# Altium project S7CAS-PLEIADES-CARTE-MERE_P20.PrjPcb (part 1 of 5)
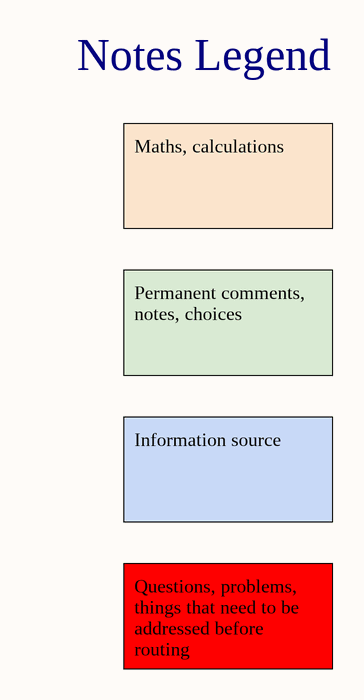
[diagram p0: S7CAS-PLEIADES-CARTE-MERE_P20_Title.SchDoc]
Project_Date: 24-01-12; Project_Designer1: Florent Cournoyer; Project_Designer2: Charles Normandeau; Project_Global: S7_APP1; Project_Group: P20: couf1001-norc2802; Project_Name: S7CAS-PLEIADES-CARTE-MERE_P20; Project_Revision: 1.00
20 sheets, 598 parts. Net scope: flat (ports and power ports of the same name join across sheets).
Board file: S7CAS-PLEIADES-CARTE-MERE-P20_PCBPcbDoc.PcbDoc
Sheets:
  S7CAS-PLEIADES-CARTE-MERE_P20_Title.SchDoc
  S7CAS-PLEIADES-CARTE-MERE_P20_Power-Tree-Analysis.SchDoc
  S7CAS-PLEIADES-CARTE-MERE_P20_Power-Tree-1.SchDoc
  S7CAS-PLEIADES-CARTE-MERE_P20_Power-Tree-2.SchDoc
  S7CAS-PLEIADES-CARTE-MERE_P20_Power-Tree-3.SchDoc
  S7CAS-PLEIADES-CARTE-MERE_P20_DDR3-FPGA-Bank-3.SchDoc
  S7CAS-PLEIADES-CARTE-MERE_P20_DDR3-Decoupling.SchDoc
  S7CAS-PLEIADES-CARTE-MERE_P20_Flash-Sensors-FPGA-bank-2.SchDoc
  S7CAS-PLEIADES-CARTE-MERE_P20_Mechanical-FPGA-Bank-0.SchDoc
  S7CAS-PLEIADES-CARTE-MERE_P20_FPGA-Unused-Banks.SchDoc
  S7CAS-PLEIADES-CARTE-MERE_P20_FPGA-Decoupling.SchDoc
  S7CAS-PLEIADES-CARTE-MERE_P20_Ethernet.SchDoc
  S7CAS-PLEIADES-CARTE-MERE_P20_USB.SchDoc
  S7CAS-PLEIADES-CARTE-MERE_P20_PLL.SchDoc
  S7CAS-PLEIADES-CARTE-MERE_P20_DAC.SchDoc
  S7CAS-PLEIADES-CARTE-MERE_P20_ADC.SchDoc
  S7CAS-PLEIADES-CARTE-MERE_P20_DAC-ADC-Spice-Models.SchDoc
  S7CAS-PLEIADES-CARTE-MERE_P20_DAC-ADC-Decoupling.SchDoc
  S7CAS-PLEIADES-CARTE-MERE_P20_Motor.SchDoc
  S7CAS-PLEIADES-CARTE-MERE_P20_Passive-Components.SchDoc

## Sheet S7CAS-PLEIADES-CARTE-MERE_P20_Title.SchDoc
size Tabloid; DocumentNumber: 1; SheetNumber: 1; SheetTotal: 19; Sheet_Name: Insert name in Document Parameters; Size: 11x17

### Notes on the sheet
- Notes Legend
- Maths, calculations
- Permanent comments, notes, choices
- Information source
- Questions, problems, things that need to be addressed before routing
- Revision history
- Package size conversion
- Metric
- 1005
- 1608
- Imperial
- 0402
- 0603
- Revision
- 2012
- 3216
- 0805
- 1206
- 3225
- 6432
- 1210
- 2512
- Date :
- Project Title
- Global Project
- Size
- Group
- Date
- Sheet
- of
- Filename
- Designers

## Sheet S7CAS-PLEIADES-CARTE-MERE_P20_Power-Tree-Analysis.SchDoc
size Tabloid; SheetNumber: 2; SheetTotal: 20; Sheet_Name: Power Tree Analysis; Size: 11x17

### Notes on the sheet
- Sheet Name
- Project Title
- Global Project
- Size
- Group
- Revision
- Date
- Sheet
- of
- Filename
- Designers
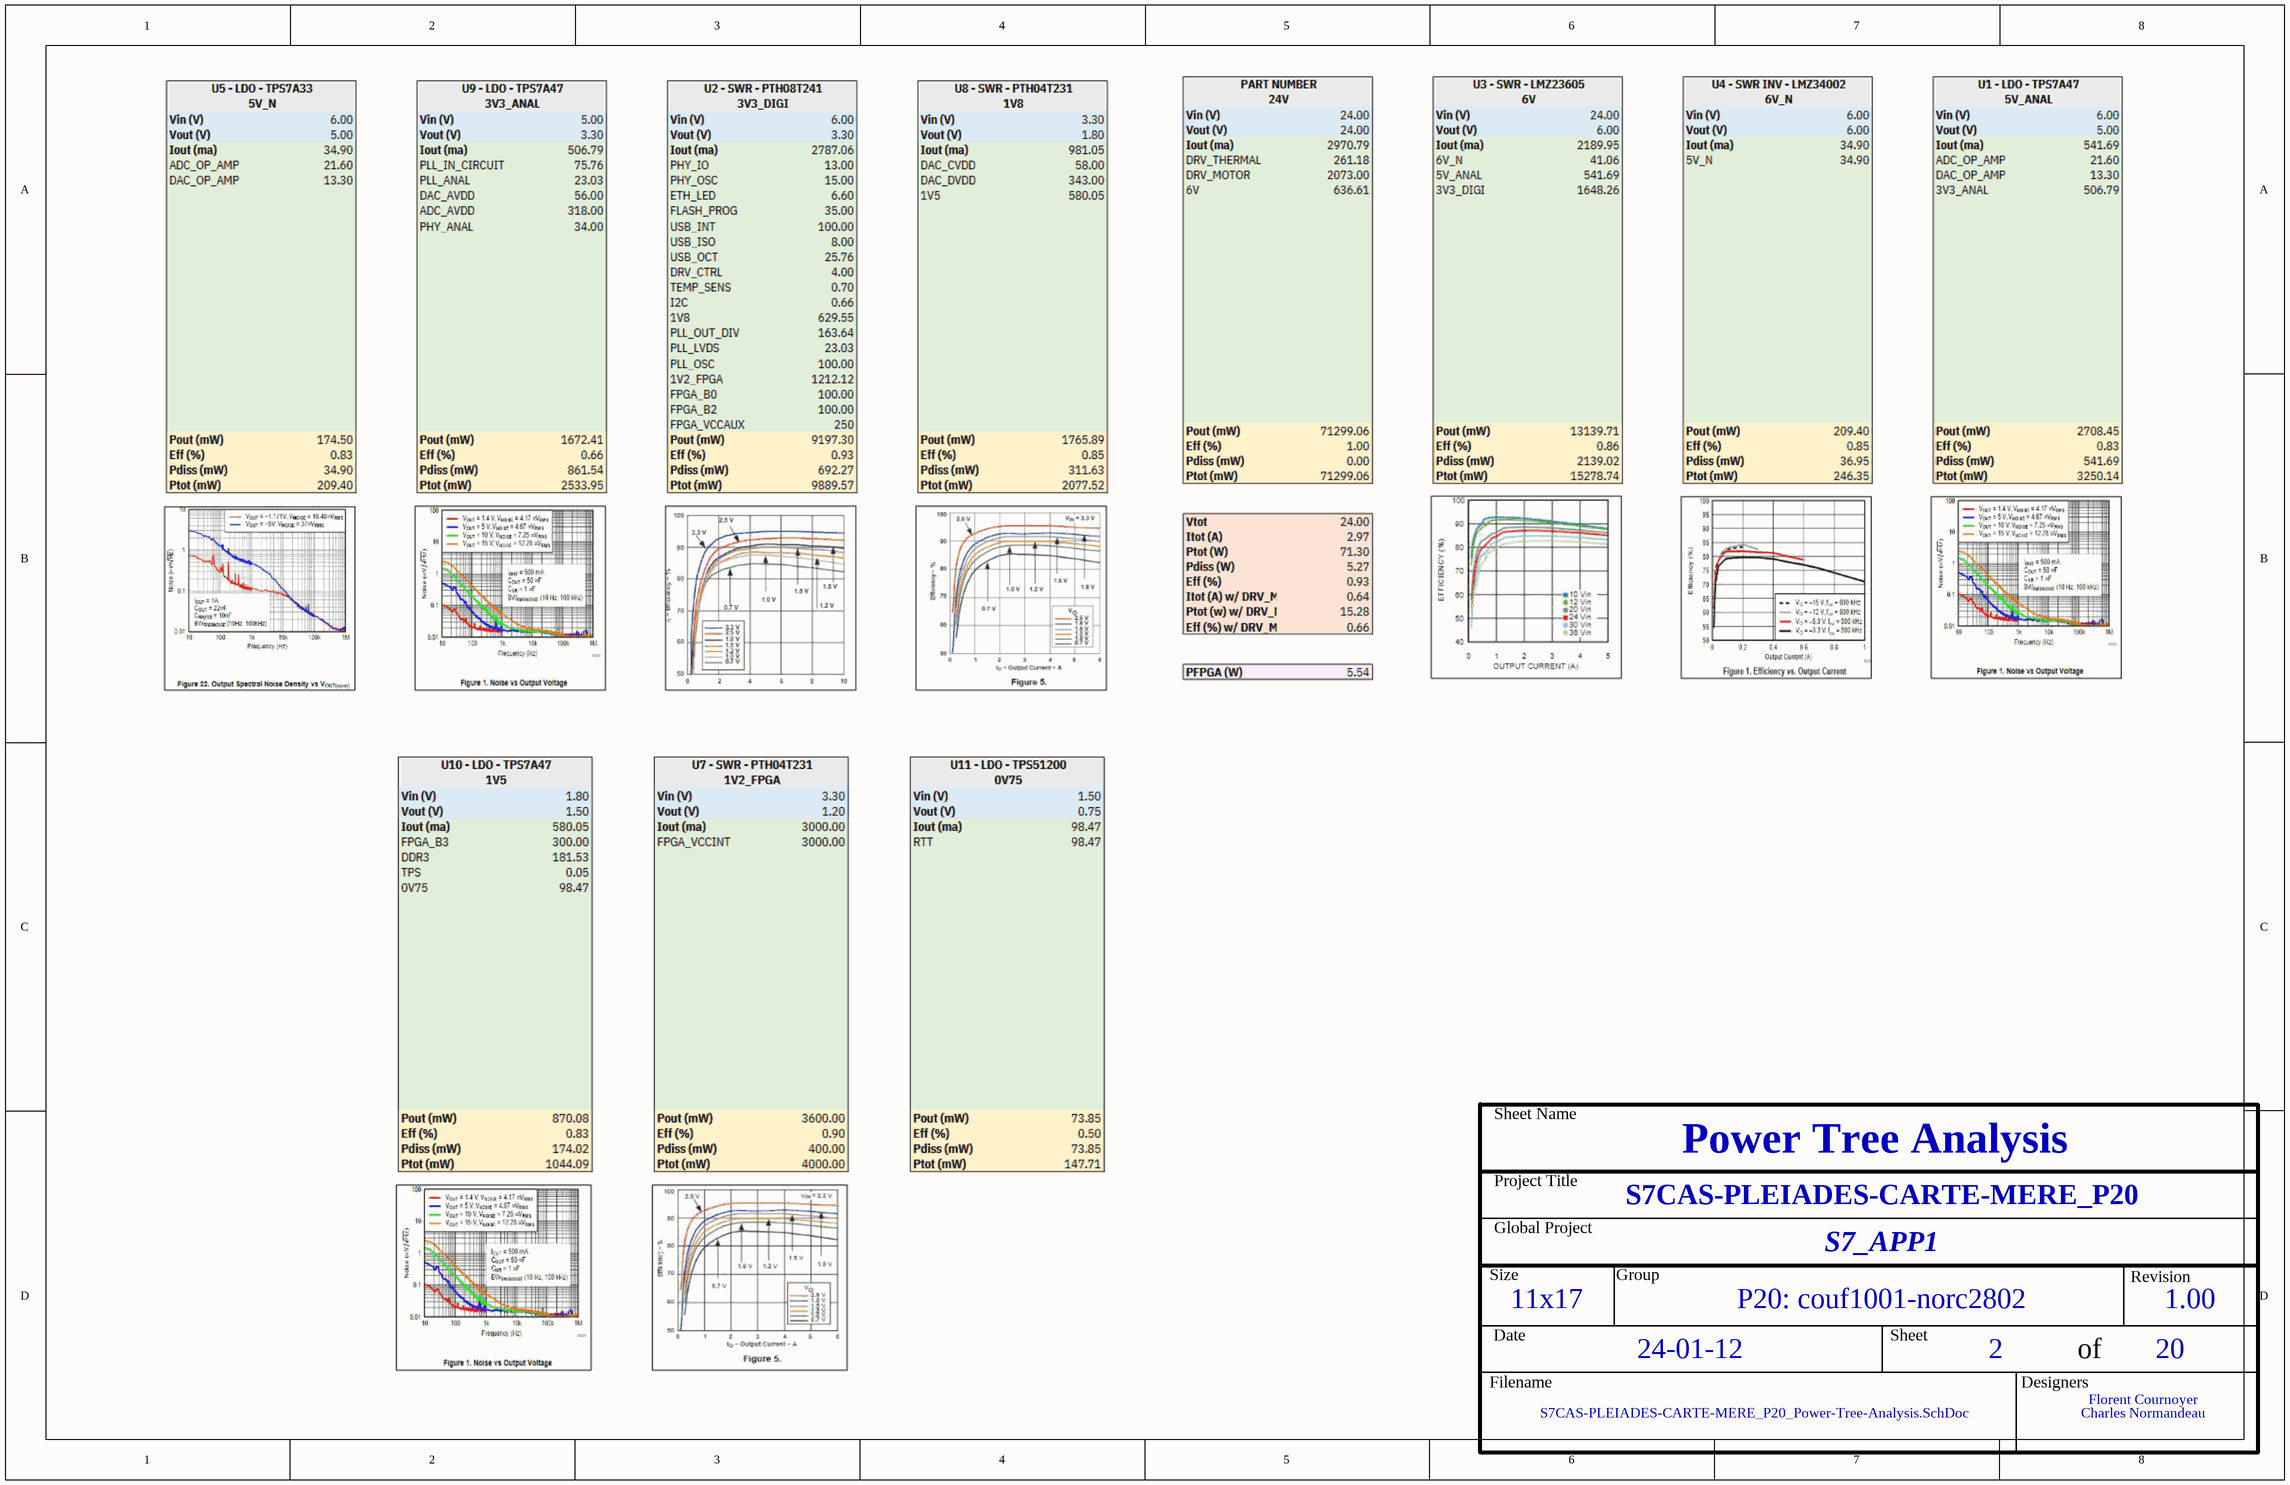
[diagram p1: S7CAS-PLEIADES-CARTE-MERE_P20_Power-Tree-Analysis.SchDoc]

## Sheet S7CAS-PLEIADES-CARTE-MERE_P20_Power-Tree-1.SchDoc
size Tabloid; SheetNumber: 3; SheetTotal: 20; Sheet_Name: Power Tree 1/3; Size: 11x17
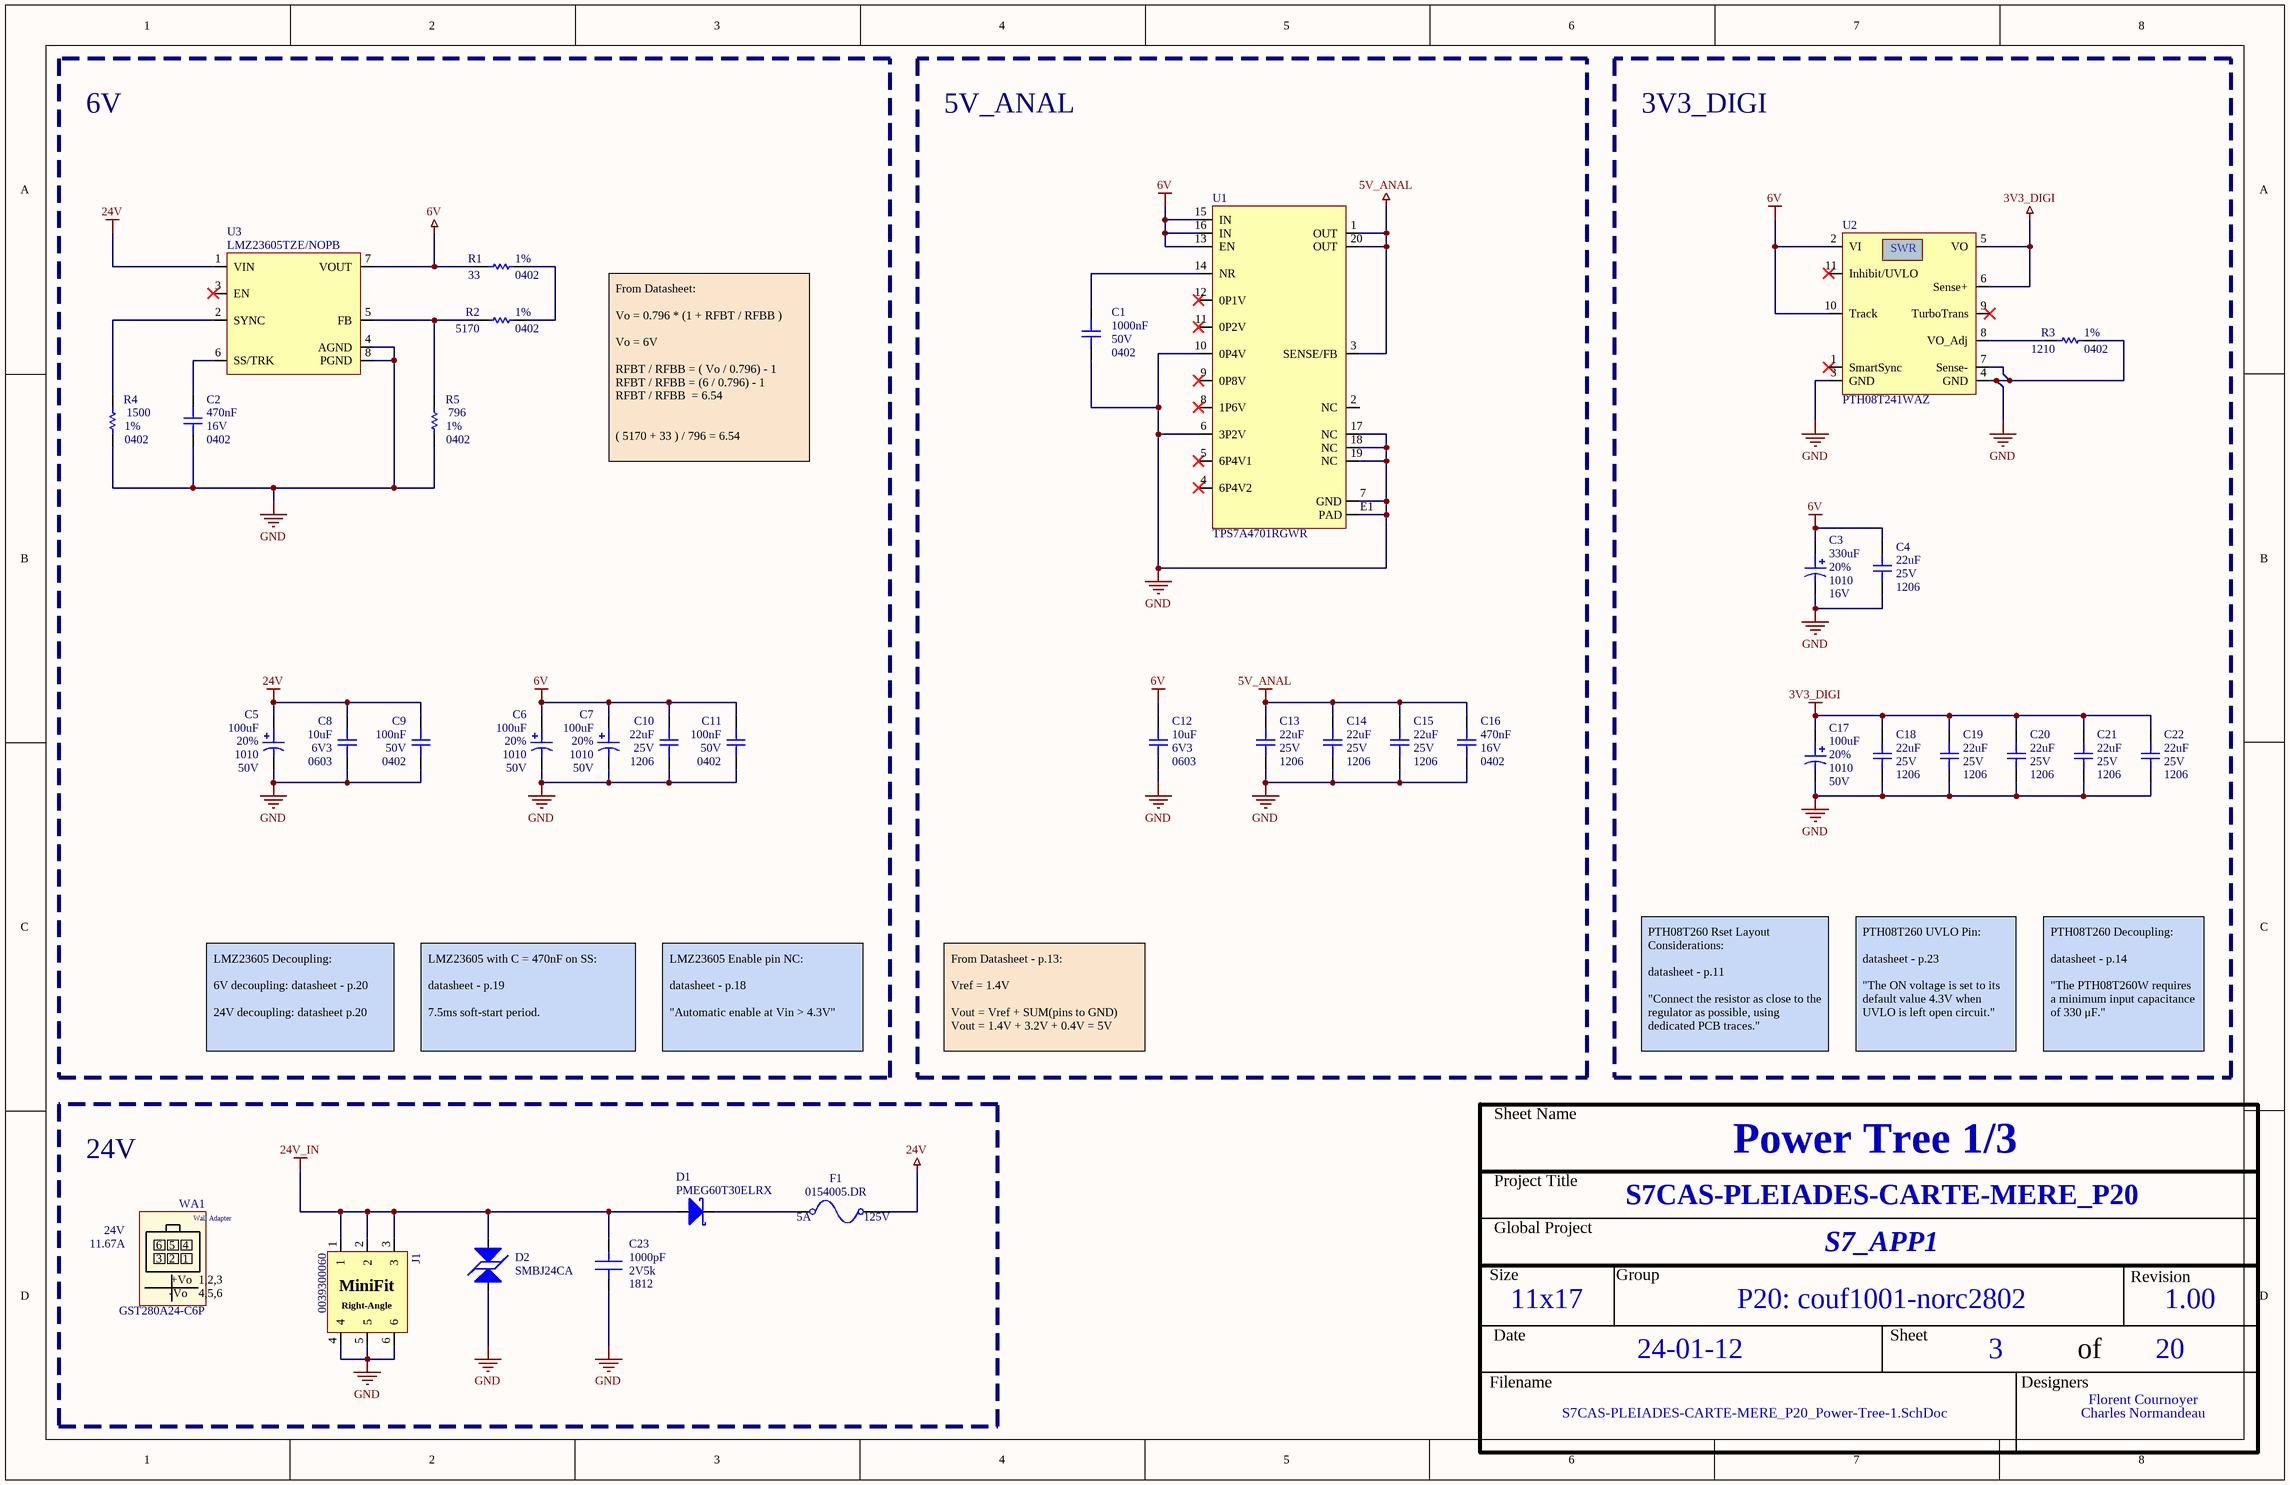
[diagram p2: S7CAS-PLEIADES-CARTE-MERE_P20_Power-Tree-1.SchDoc]

### Parts
C1  value 1000nF  Voltage: 50V  Package: 0402  [CAP_0402]  (hidden comment: CAP - 0402)
C2  value 470nF  Voltage: 16V  Package: 0402  [CAP_0402]  (hidden comment: CAP - 0402)
C3  value 330uF  Voltage: 16V  Package: 1010  Precision: 20%  [CAP_ALU_1010_vishay]  (hidden comment: MAL214699501E3)
C4  value 22uF  Voltage: 25V  Package: 1206  [CAP_1206]  (hidden comment: CAP - 1206)
C5  value 100uF  Voltage: 50V  Package: 1010  Precision: 20%  [CAP_ALU_1010_vishay]  (hidden comment: MAL215099101E3)
C6  value 100uF  Voltage: 50V  Package: 1010  Precision: 20%  [CAP_ALU_1010_vishay]  (hidden comment: MAL215099101E3)
C7  value 100uF  Voltage: 50V  Package: 1010  Precision: 20%  [CAP_ALU_1010_vishay]  (hidden comment: MAL215099101E3)
C8  value 10uF  Voltage: 6V3  Package: 0603  [CAP_0603]  (hidden comment: CAP - 0603)
C9  value 100nF  Voltage: 50V  Package: 0402  [CAP_0402]  (hidden comment: CAP - 0402)
C10  value 22uF  Voltage: 25V  Package: 1206  [CAP_1206]  (hidden comment: CAP - 1206)
C11  value 100nF  Voltage: 50V  Package: 0402  [CAP_0402]  (hidden comment: CAP - 0402)
C12  value 10uF  Voltage: 6V3  Package: 0603  [CAP_0603]  (hidden comment: CAP - 0603)
C13  value 22uF  Voltage: 25V  Package: 1206  [CAP_1206]  (hidden comment: CAP - 1206)
C14  value 22uF  Voltage: 25V  Package: 1206  [CAP_1206]  (hidden comment: CAP - 1206)
C15  value 22uF  Voltage: 25V  Package: 1206  [CAP_1206]  (hidden comment: CAP - 1206)
C16  value 470nF  Voltage: 16V  Package: 0402  [CAP_0402]  (hidden comment: CAP - 0402)
C17  value 100uF  Voltage: 50V  Package: 1010  Precision: 20%  [CAP_ALU_1010_vishay]  (hidden comment: MAL215099101E3)
C18  value 22uF  Voltage: 25V  Package: 1206  [CAP_1206]  (hidden comment: CAP - 1206)
C19  value 22uF  Voltage: 25V  Package: 1206  [CAP_1206]  (hidden comment: CAP - 1206)
C20  value 22uF  Voltage: 25V  Package: 1206  [CAP_1206]  (hidden comment: CAP - 1206)
C21  value 22uF  Voltage: 25V  Package: 1206  [CAP_1206]  (hidden comment: CAP - 1206)
C22  value 22uF  Voltage: 25V  Package: 1206  [CAP_1206]  (hidden comment: CAP - 1206)
C23  value 1000pF  Package: 1812  Voltage Rating: 2V5k  [CAP_CER_1812]  (hidden comment: 1812WC102KAT1A)
D1  PMEG60T30ELRX  [DIO_SCHOTTKY_PMEG60T30ELRX]
D2  SMBJ24CA  [TVS_PWR_SMBJ36CA]
F1  0154005.DR  Voltage Rating: 125V  Current Rating: 5A  [FUS_0154XXX.DR]
J1  0039300060  [CON_MINIFIT_0039300060]
R1  value 33  Package: 0402  Precision: 1%  [RES_0402]  (hidden comment: RES - 0402)
R2  value 5170  Package: 0402  Precision: 1%  [RES_0402]  (hidden comment: RES - 0402)
R3  value 1210  Package: 0402  Precision: 1%  [RES_0402]  (hidden comment: RES - 0402)
R4  value 1500  Package: 0402  Precision: 1%  [RES_0402]  (hidden comment: RES - 0402)
R5  value 796  Package: 0402  Precision: 1%  [RES_0402]  (hidden comment: RES - 0402)
U1  TPS7A4701RGWR  [REG_TPS7A4701RGWR]
U2  PTH08T241WAZ  [REG_SWR_PTH08T241WAZ]
U3  LMZ23605TZE/NOPB  [REG_SWR_LMZ23605TZE/NOPB]
WA1  GST280A24-C6P  value 24V  Current Rating: 11.67A  [Model Name]  (mechanical)

### Blocks framed on the sheet
6V: C2 C5-C11 R1 R2 R4 R5 U3
5V_ANAL: C1 C12-C16 U1
3V3_DIGI: C3 C4 C17-C22 R3 U2
24V: C23 D1 D2 F1 J1 WA1

### Nets
3V3_DIGI: C17.1 C18.2 C19.2 C20.2 C21.2 C22.2 U2.5(VO) U2.6(Sense+)
5V_ANAL: C13.2 C14.2 C15.2 C16.2 U1.1(OUT) U1.3(SENSE/FB) U1.20(OUT)
6V: C3.1 C4.2 C6.1 C7.1 C10.2 C11.2 C12.2 R1.2 U1.13(EN) U1.15(IN) U1.16(IN) U2.2(VI) U2.10(Track) U3.7(VOUT)
24V: C5.1 C8.2 C9.2 F1.2 U3.1(VIN)
24V_IN: C23.1 D1.A D2.1 J1.1 J1.2 J1.3
GND: C1.2 C2.1 C3.2 C4.1 C5.2 C6.2 C7.2 C8.1 C9.1 C10.1 C11.1 C12.1 C13.1 C14.1 C15.1 C16.1 C17.2 C18.1 C19.1 C20.1 C21.1 C22.1 C23.2 D2.2 J1.4 J1.5 J1.6 R3.1 R4.1 R5.1 U1.6(3P2V) U1.7(GND) U1.10(0P4V) U1.17(NC) U1.18(NC) U1.19(NC) U1.E1(PAD) U2.3(GND) U2.4(GND) U2.7(Sense-) U3.4(AGND) U3.8(PGND)
NetC1_1: C1.1 U1.14(NR)
NetC2_2: C2.2 U3.6(SS/TRK)
NetD1_K: D1.K F1.1
NetR1_1: R1.1 R2.1
NetR2_2: R2.2 R5.2 U3.5(FB)
NetR3_2: R3.2 U2.8(VO_Adj)
NetR4_2: R4.2 U3.2(SYNC)

Not connected (* = marked no-connect by the designer): U1 2(NC) 4(6P4V2)* 5(6P4V1)* 8(1P6V)* 9(0P8V)* 11(0P2V)* 12(0P1V)*; U2 1(SmartSync)* 9(TurboTrans)* 11(Inhibit/UVLO)*; U3 3(EN)*

### Notes on the sheet
- From Datasheet:
  Vo = 0.796 * (1 + RFBT / RFBB )
  Vo = 6V
  RFBT / RFBB = ( Vo / 0.796) - 1
  RFBT / RFBB = (6 / 0.796) - 1
  RFBT / RFBB  = 6.54
  ( 5170 + 33 ) / 796 = 6.54
- LMZ23605 Decoupling:
  6V decoupling: datasheet - p.20
  24V decoupling: datasheet p.20
- LMZ23605 with C = 470nF on SS:
  datasheet - p.19
  7.5ms soft-start period.
- LMZ23605 Enable pin NC:
  datasheet - p.18
  "Automatic enable at Vin > 4.3V"
- From Datasheet - p.13:
  Vref = 1.4V
  Vout = Vref + SUM(pins to GND)
  Vout = 1.4V + 3.2V + 0.4V = 5V
- PTH08T260 Rset Layout Considerations:
  datasheet - p.11
  "Connect the resistor as close to the regulator as possible, using dedicated PCB traces."
- PTH08T260 UVLO Pin:
  datasheet - p.23
  "The ON voltage is set to its default value 4.3V when UVLO is left open circuit."
- PTH08T260 Decoupling:
  datasheet - p.14
  "The PTH08T260W requires a minimum input capacitance of 330 μF."
- Sheet Name
- Project Title
- Global Project
- Size
- Group
- Revision
- Date
- Sheet
- of
- Filename
- Designers
- (in symbol CON_MINIFIT_0039300060) MiniFit; Right-Angle
- (in symbol REG_SWR_PTH08T241WAZ) SWR
- (in symbol UND_GST280A24-C6P) Wall Adapter; 6; 5; 4; 3; 2; 1; +Vo; 1,2,3; -Vo; 4,5,6

### Library data of the parts
C1 = CAP - 0402: Mfg Part Number: GXT155R61E105KE01; Precision: 10%; Current: *; CreatedBy: Jonathan Bouchard; Power: *
C2 C16 = CAP - 0402: Mfg Part Number: GXT155R61C474KE01; Precision: 10%; Current: *; CreatedBy: Jonathan Bouchard; Power: *
C3 = CAP_ALU_MAL214699501E3: CAP - ALU 330uF 20% 16V - 1010; Current: 750mA; Mfg: Vishay Dale; Mfg Part Number: MAL214699501E3; HelpURL: http://www.vishay.com/docs/28403/146cti.pdf; CreatedBy: Jonathan Bouchard; Temperature: -55°C to 125°C; Power: *; Supplier 1: Digikey; Supplier Part Number 1: 4405PHCT-ND
C4 C10 C13-C15 C18-C22 = CAP - 1206: Mfg Part Number: GRM31CC81E226KE11; Precision: 10%; Current: *; HelpURL: https://search.murata.co.jp/Ceramy/image/img/A01X/G101/ENG/GRM31CD71H106KE11-01A.pdf; CreatedBy: Jonathan Bouchard; Power: *
C5-C7 C17 = CAP_ALU_MAL215099101E3: CAP - ALU 100uF 20% 50V - 1010; Current: 490mA; Mfg: Vishay Dale; Mfg Part Number: MAL215099101E3; HelpURL: http://www.vishay.com/docs/28395/150crz.pdf; CreatedBy: Jonathan Bouchard; Temperature: -55°C to 125°C; Power: *; Supplier 1: Digikey; Supplier Part Number 1: 4399PHDKR-ND
C8 C12 = CAP - 0603: Mfg Part Number: GRM185R60J106ME15; Precision: 20%; Current: *; CreatedBy: Jonathan Bouchard; Power: *
C9 C11 = CAP - 0402: Mfg Part Number: GRM155R61H104KE14; Precision: 10%; Current: *; CreatedBy: Jonathan Bouchard; Power: *
C23 = CAP_CER_1812WC102KAT1A: CAP - CER 1000PF 2.5KV X7R - 1812; Tolerance: 10%; GRAMS Lib Spec: 2.7; Temperature: -55 to 125C
D1 = DIO_SCHOTTKY_PMEG60T30ELRX: DIO -  SCHOTTKY 60V 3A - SOD-123W; Manufacturer #1: Nexperia USA Inc.; GRAMS Lib Spec: 2.8c; Magnetic Material: UNKNOWN; Polarized: YES; Value: 620mV @ 3A; Assembly Type: SMD; CreatedBy/Date: Jonathan Bouchard 2020-03-23; Current Rating: 3A; HelpURL: https://assets.nexperia.com/documents/data-sheet/PMEG60T30ELR.pdf; Manufacturer #2: *; Note: *; Package: SOD-123W; Part Number #1: PMEG60T30ELRX; Part Number #2: *; Power Max: *; Supplier 1: Digi-Key; Supplier Part Number 1: 1727-7806-1-ND; Temperature: 175°C (Max); Tolerance: *; VerifiedBy: C.Paulin - 22/04/2020; Voltage Rating: 60V; Cryo: UNKNOWN; Mfg Part Number: PMEG60T30ELRX
D2 = TVS_PWR_SMBJ24CA: TVS - 24V 26.7V 600W - DO214AA; Manufacturer #1: Littelfuse Inc.; Value: Vbr = 26.7V -  Clamp = 38.9V; Voltage Rating: 24V Standoff; Current Rating: 15.5A; GRAMS Lib Spec: 2.8; Magnetic Material: UNKNOWN; Polarized: NO; Tolerance: *; Power Max: 600W; HelpURL: http://www.littelfuse.com/~/media/electronics/datasheets/tvs_diodes/littelfuse_tvs_diode_smbj_datasheet.pdf.pdf; CreatedBy/Date: Arnaud Samson - 06/07/18; VerifiedBy: Jonathan Bouchard - 2018-07-13; Temperature: -65°C ~ 150°C (TJ); Package: DO214AA; Manufacturer #2: *; Note: *; Assembly Type: SMD; Part Number #2: *; Part Number #1: SMBJ24CA; Supplier 1: Digi-Key; Supplier Part Number 1: SMBJ24CALFCT-ND; Cryo: UNKNOWN; Mfg Part Number: SMBJ24CA
F1 = FUS_0154005.DR: FUS - 5 A 125 VAC/VDC - 2-SMD; Manufacturer #1: Littelfuse Inc.; Value: 5A 125V AC/DC FAST; GRAMS Lib Spec: 2.8; Magnetic Material: UNKNOWN; Polarized: NO; Tolerance: *; Power Max: *; HelpURL: http://www.littelfuse.com/~/media/electronics/datasheets/fuses/littelfuse_fuse_154_154t_154l_154tl_datasheet.pdf.pdf; CreatedBy/Date: Arnaud Samson - 06/07/18; VerifiedBy: Jonathan Bouchard 2018-07-16; Temperature: -55°C ~ 125°C; Package: 2-SMD; Manufacturer #2: *; Note: *; Assembly Type: SMD; Part Number #2: *; Part Number #1: 0154005.DR; Supplier 1: Digi-Key; Supplier Part Number 1: F1228CT-ND; Cryo: UNKNOWN
J1 = CON_MINIFIT_0039300060: CON - Mini-Fit Through Hole, Right Angle 6 position; Manufacturer #1: Molex; Current Rating: 8A; GRAMS Lib Spec: 2.8; Magnetic Material: Unknown; Polarized: Yes; Voltage Rating: 600V; Assembly Type: TH; CreatedBy/Date: Joel Lemay 2018-06-21; HelpURL: https://www.molex.com/pdm_docs/sd/039300060_sd.pdf; Manufacturer #2: *; Package: TH; Part Number #1: 0039300060; Part Number #2: *; Power Max: *; Supplier 1: Digi-Key; Supplier Part Number 1: WM21353-ND; Temperature: - 40°C to + 80°C; Tolerance: *; Value: *; VerifiedBy: Caroline Paulin - 10 sept 2018; Cryo: UNKNOWN
R1 = RES - 0402: Mfg Part Number: CRCW040233R0FKEDC; Voltage: 50V; Power: 1/16W; Current: *; CreatedBy: Jonathan Bouchard
R2 = RES - 0402: Mfg Part Number: RN73H1ETTP5171F50; Voltage: 50V; Power: 1/16W; Current: *; CreatedBy: Jonathan Bouchard
R3 = RES - 0402: Mfg Part Number: CRCW04021K21FKEDC; Voltage: 50V; Power: 1/16W; Current: *; CreatedBy: Jonathan Bouchard
R4 = RES - 0402: Voltage: 50V; Power: 1/16W; Current: *; CreatedBy: Jonathan Bouchard
R5 = RES - 0402: Mfg Part Number: RN73H1ETTP7960F50; Voltage: 50V; Power: 1/16W; Current: *; CreatedBy: Jonathan Bouchard
U1 = REG_LDO_TPS7A4701RGWR: REG - LINEAR POS ADJ 1A - 20VQFN; Manufacturer #1: Texas Instruments; GRAMS Lib Spec: 2.8; Magnetic Material: Unknown; Polarized: Yes; Value: 1.4 à 34V; Voltage rating: 35V max; Assembly Type: SMD; CreatedBy/Date: L-P Gauthier / 2018-05-29; Current Rating: 1A; Manufacturer #2: TBD; Part Number #1: TPS7A4701RGWR; Part Number #2: TBD; Package: 20-VQFN Exposed Pad; Power Max: *; Tolerance: -; Supplier 1: Digi-Key; Supplier Part Number 1: 296-37224-1-ND; VerifiedBy: Caroline Paulin - 28 sept 2018; Temperature: -40°C ~ 125°C; HelpURL: http://www.ti.com/lit/ds/symlink/tps7a47.pdf; Cryo: UNKNOWN; Mfg Part Number: TPS7A4701RGWR
U2 = REG_SWR_PTH08T241WAZ: REG - MODULE PIP 10A 14VIN - 11-SMD; Manufacturer #1: Texas Instruments; Current Rating: 10A (out); Voltage rating: 4.5-14V (Input), 0.69 - 5.5V (Out); Polarized: Yes; Magnetic Material: UNKNOWN; Manufacturer #2: *; Note: *; Power Max: *; Value: *; Part Number #1: PTH08T241WAZ; Part Number #2: *; HelpURL: http://www.ti.com/lit/ds/symlink/pth08t241w.pdf; Supplier 1: Digi-Key; Supplier Part Number 1: 296-21339-ND; Assembly Type: SMD; Temperature: -40°C ~ 85°C; Package: SMD; CreatedBy/Date: Olivier Bernard / 6/5/2018; VerifiedBy: Caroline Paulin / 10 juillet 2018; Cryo: UNKNOWN; Mfg Part Number: PTH08T241WAZ
U3 = REG_SWR_LMZ23605TZE/NOPB: REG - IC BUCK SYNC 36V 5A - TO-PMOD-7; Manufacturer #1: Texas Instruments; Value: 0.8 ~ 6 V; Voltage Rating: 6 ~ 36 V; GRAMS Lib Spec: 2.8; Note: One Reflow; Magnetic Material: YES; Cryo: UNKNOWN; Tolerance: *; Current Rating: 5A; Power Max: *; HelpURL: http://www.ti.com/lit/ds/symlink/lmz23605.pdf; CreatedBy/Date: Arnaud Samson - 05/07/18; VerifiedBy: Jonathan Bouchard 2018-07-13; Temperature: -40°C ~ 125°C; Package: TO-PMOD-7; Manufacturer #2: *; Assembly Type: SMD; Part Number #2: *; Part Number #1: LMZ23605TZE/NOPB; Polarized: YES; Supplier 1: Digi-Key; Supplier Part Number 1: 296-35357-1-ND; Mfg Part Number: LMZ23605TZE/NOPB
WA1 = UND_GST280A24-C6P: UND - AC/DC DESKTOP ADAPTER 24V 280W - MEC; Manufacturer #1: MEAN WELL USA Inc.; Tolerance: ±3%; Voltage Rating: 85~264VAC; GRAMS Lib Spec: 2.8; Magnetic Material: Unknown; Polarized: Yes; Power Max: 280W; HelpURL: https://www.meanwell.com/Upload/PDF/GST280A/GST280A-SPEC.PDF; CreatedBy/Date: Caroline Paulin - 5 avril 2019; VerifiedBy: Nicolas V. (2019-07-05); Temperature: -30°C to +70°C; Package: -; Manufacturer #2: *; Note: *; Assembly Type: -; Part Number #2: *; Part Number #1: GST280A24-C6P; Supplier 1: Digi-Key; Supplier Part Number 1: 1866-2122-ND; Cryo: UNKNOWN; Mfg Part Number: GST280A24-C6P

## Sheet S7CAS-PLEIADES-CARTE-MERE_P20_Power-Tree-2.SchDoc
size Tabloid; SheetNumber: 4; SheetTotal: 20; Sheet_Name: Power Tree 2/3; Size: 11x17
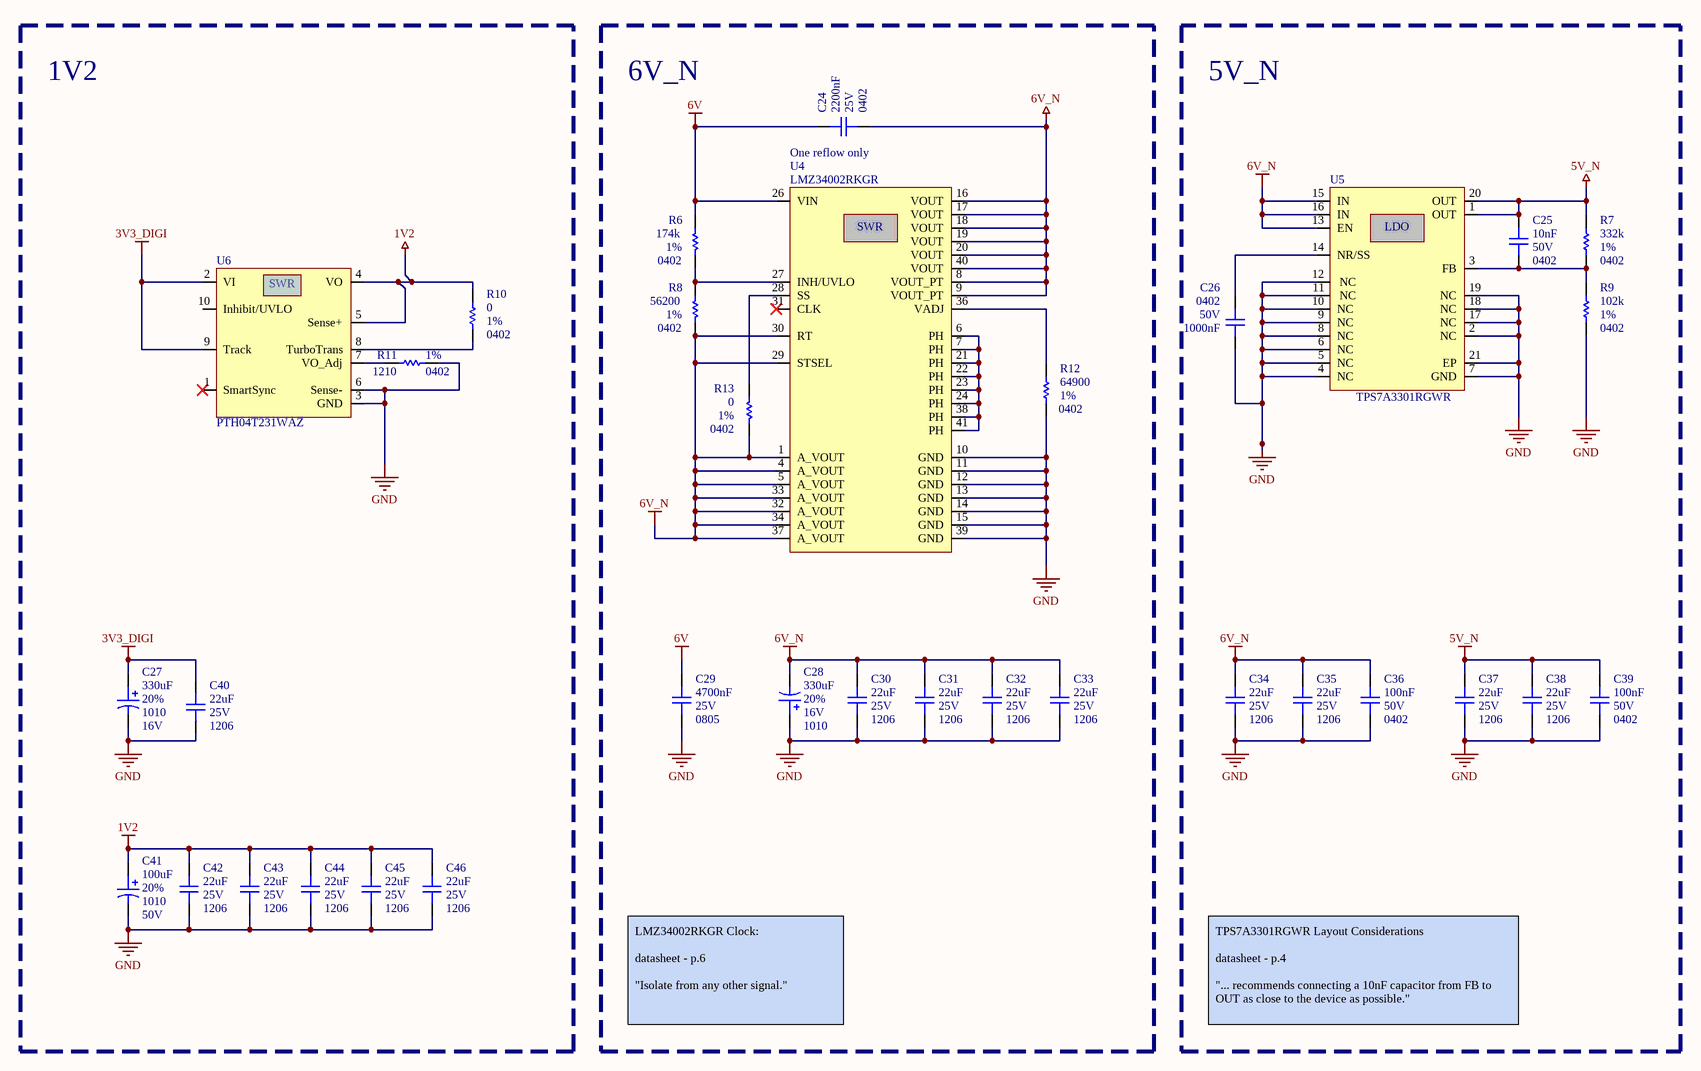
[diagram p3: S7CAS-PLEIADES-CARTE-MERE_P20_Power-Tree-2.SchDoc]

### Parts
C24  value 2200nF  Voltage: 25V  Package: 0402  [CAP_0402]  (hidden comment: CAP - 0402)
C25  value 10nF  Voltage: 50V  Package: 0402  [CAP_0603]  (hidden comment: CAP - 0603)
C26  value 1000nF  Voltage: 50V  Package: 0402  [CAP_0402]  (hidden comment: CAP - 0402)
C27  value 330uF  Voltage: 16V  Package: 1010  Precision: 20%  [CAP_ALU_1010_vishay]  (hidden comment: MAL214699501E3)
C28  value 330uF  Voltage: 16V  Package: 1010  Precision: 20%  [CAP_ALU_1010_vishay]  (hidden comment: MAL214699501E3)
C29  value 4700nF  Voltage: 25V  Package: 0805  [CAP_0805]  (hidden comment: CAP - 0805)
C30  value 22uF  Voltage: 25V  Package: 1206  [CAP_1206]  (hidden comment: CAP - 1206)
C31  value 22uF  Voltage: 25V  Package: 1206  [CAP_1206]  (hidden comment: CAP - 1206)
C32  value 22uF  Voltage: 25V  Package: 1206  [CAP_1206]  (hidden comment: CAP - 1206)
C33  value 22uF  Voltage: 25V  Package: 1206  [CAP_1206]  (hidden comment: CAP - 1206)
C34  value 22uF  Voltage: 25V  Package: 1206  [CAP_1206]  (hidden comment: CAP - 1206)
C35  value 22uF  Voltage: 25V  Package: 1206  [CAP_1206]  (hidden comment: CAP - 1206)
C36  value 100nF  Voltage: 50V  Package: 0402  [CAP_0402]  (hidden comment: CAP - 0402)
C37  value 22uF  Voltage: 25V  Package: 1206  [CAP_1206]  (hidden comment: CAP - 1206)
C38  value 22uF  Voltage: 25V  Package: 1206  [CAP_1206]  (hidden comment: CAP - 1206)
C39  value 100nF  Voltage: 50V  Package: 0402  [CAP_0402]  (hidden comment: CAP - 0402)
C40  value 22uF  Voltage: 25V  Package: 1206  [CAP_1206]  (hidden comment: CAP - 1206)
C41  value 100uF  Voltage: 50V  Package: 1010  Precision: 20%  [CAP_ALU_1010_vishay]  (hidden comment: MAL215099101E3)
C42  value 22uF  Voltage: 25V  Package: 1206  [CAP_1206]  (hidden comment: CAP - 1206)
C43  value 22uF  Voltage: 25V  Package: 1206  [CAP_1206]  (hidden comment: CAP - 1206)
C44  value 22uF  Voltage: 25V  Package: 1206  [CAP_1206]  (hidden comment: CAP - 1206)
C45  value 22uF  Voltage: 25V  Package: 1206  [CAP_1206]  (hidden comment: CAP - 1206)
C46  value 22uF  Voltage: 25V  Package: 1206  [CAP_1206]  (hidden comment: CAP - 1206)
R6  value 174k  Package: 0402  Precision: 1%  [RES_0402]  (hidden comment: RES - 0402)
R7  value 332k  Package: 0402  Precision: 1%  [RES_0402]  (hidden comment: RES - 0402)
R8  value 56200  Package: 0402  Precision: 1%  [RES_0402]  (hidden comment: RES - 0402)
R9  value 102k  Package: 0402  Precision: 1%  [RES_0402]  (hidden comment: RES - 0402)
R10  value 0  Package: 0402  Precision: 1%  [RES_0402]  (hidden comment: RES - 0402)
R11  value 1210  Package: 0402  Precision: 1%  [RES_0402]  (hidden comment: RES - 0402)
R12  value 64900  Package: 0402  Precision: 1%  [RES_0402]  (hidden comment: RES - 0402)
R13  value 0  Package: 0402  Precision: 1%  [RES_0402]  (hidden comment: RES - 0402)
U4  LMZ34002RKGR  Assembly Note: One reflow only  [REG_SWR_LMZ34002RKGR]
U5  TPS7A3301RGWR  [REG_LDO_TPS7A3301RGWR]
U6  PTH04T231WAZ  [REG_SWR_PTH04T231WAZ]

### Blocks framed on the sheet
1V2: C27 C40-C46 R10 R11 U6
6V_N: C24 C28-C33 R6 R8 R12 R13 U4
5V_N: C25 C26 C34-C39 R7 R9 U5

### Nets
1V2: C41.1 C42.2 C43.2 C44.2 C45.2 C46.2 R10.2 U6.4(VO) U6.5(Sense+)
3V3_DIGI: C27.1 C40.2 U6.2(VI) U6.9(Track)
5V_N: C25.2 C37.2 C38.2 C39.2 R7.2 U5.1(OUT) U5.20(OUT)
6V: C24.2 C29.2 R6.2 U4.26(VIN)
6V_N: C24.1 C28.2 C30.2 C31.2 C32.2 C33.2 C34.2 C35.2 C36.2 R8.1 R13.1 U4.1(A_VOUT) U4.4(A_VOUT) U4.5(A_VOUT) U4.8(VOUT_PT) U4.9(VOUT_PT) U4.16(VOUT) U4.17(VOUT) U4.18(VOUT) U4.19(VOUT) U4.20(VOUT) U4.29(STSEL) U4.30(RT) U4.32(A_VOUT) U4.33(A_VOUT) U4.34(A_VOUT) U4.37(A_VOUT) U4.40(VOUT) U5.13(EN) U5.15(IN) U5.16(IN)
GND: C26.1 C27.2 C28.1 C29.1 C30.1 C31.1 C32.1 C33.1 C34.1 C35.1 C36.1 C37.1 C38.1 C39.1 C40.1 C41.2 C42.1 C43.1 C44.1 C45.1 C46.1 R9.1 R11.1 R12.1 U4.10(GND) U4.11(GND) U4.12(GND) U4.13(GND) U4.14(GND) U4.15(GND) U4.39(GND) U5.2(NC) U5.4(NC) U5.5(NC) U5.6(NC) U5.7(GND) U5.8(NC) U5.9(NC) U5.10(NC) U5.11(NC) U5.12(NC) U5.17(NC) U5.18(NC) U5.19(NC) U5.21(EP) U6.3(GND) U6.6(Sense-)
NetC25_1: C25.1 R7.1 R9.2 U5.3(FB)
NetC26_2: C26.2 U5.14(NR/SS)
NetR6_1: R6.1 R8.2 U4.27(INH/UVLO)
NetR10_1: R10.1 U6.8(TurboTrans)
NetR11_2: R11.2 U6.7(VO_Adj)
NetR12_2: R12.2 U4.36(VADJ)
NetR13_2: R13.2 U4.28(SS)
NetU4_6: U4.6(PH) U4.7(PH) U4.21(PH) U4.22(PH) U4.23(PH) U4.24(PH) U4.38(PH) U4.41(PH)

Not connected (* = marked no-connect by the designer): U4 2(DNC) 3(DNC) 25(DNC) 31(CLK)* 35(DNC); U6 1(SmartSync)* 10(Inhibit/UVLO)

### Notes on the sheet
- LMZ34002RKGR Clock:
  datasheet - p.6
  "Isolate from any other signal."
- TPS7A3301RGWR Layout Considerations
  datasheet - p.4
  "... recommends connecting a 10nF capacitor from FB to OUT as close to the device as possible."
- Sheet Name
- Project Title
- Global Project
- Size
- Group
- Revision
- Date
- Sheet
- of
- Filename
- Designers
- (in symbol REG_LDO_TPS7A3301RGWR) LDO
- (in symbol REG_SWR_LMZ34002RKGR) SWR
- (in symbol REG_SWR_PTH04T231WAZ) SWR

### Library data of the parts
C24 = CAP - 0402: Mfg Part Number: GRM155R61E225KE11; Precision: 10%; Current: *; CreatedBy: Jonathan Bouchard; Power: *
C25 = CAP - 0603: Mfg Part Number: GRM155R71H103KA88; Precision: 10%; Current: *; CreatedBy: Jonathan Bouchard; Power: *
C26 = CAP - 0402: as C1 on sheet S7CAS-PLEIADES-CARTE-MERE_P20_Power-Tree-1; Current: *; CreatedBy: Jonathan Bouchard; Power: *
C27 C28 = CAP_ALU_MAL214699501E3: as C3 on sheet S7CAS-PLEIADES-CARTE-MERE_P20_Power-Tree-1; Mfg Part Number: MAL214699501E3; HelpURL: http://www.vishay.com/docs/28403/146cti.pdf; CreatedBy: Jonathan Bouchard; Temperature: -55°C to 125°C; Power: *; Supplier 1: Digikey; Supplier Part Number 1: 4405PHCT-ND
C29 = CAP - 0805: Mfg Part Number: GRM219R61E475KA73; Precision: 10%; Current: *; CreatedBy: Jonathan Bouchard; Power: *
C30-C35 C37 C38 C40 C42-C46 = CAP - 1206: as C4 on sheet S7CAS-PLEIADES-CARTE-MERE_P20_Power-Tree-1; Current: *; HelpURL: https://search.murata.co.jp/Ceramy/image/img/A01X/G101/ENG/GRM31CD71H106KE11-01A.pdf; CreatedBy: Jonathan Bouchard; Power: *
C36 C39 = CAP - 0402: as C9 on sheet S7CAS-PLEIADES-CARTE-MERE_P20_Power-Tree-1; Current: *; CreatedBy: Jonathan Bouchard; Power: *
C41 = CAP_ALU_MAL215099101E3: as C5 on sheet S7CAS-PLEIADES-CARTE-MERE_P20_Power-Tree-1; Mfg Part Number: MAL215099101E3; HelpURL: http://www.vishay.com/docs/28395/150crz.pdf; CreatedBy: Jonathan Bouchard; Temperature: -55°C to 125°C; Power: *; Supplier 1: Digikey; Supplier Part Number 1: 4399PHDKR-ND
R6 = RES - 0402: Mfg Part Number: CRCW0402174KFKEDC; Voltage: 50V; Power: 1/16W; Current: *; CreatedBy: Jonathan Bouchard
R7 = RES - 0402: Mfg Part Number: RK73H1FTTBL3323F; Voltage: 50V; Power: 1/32W; Current: *; CreatedBy: Jonathan Bouchard
R8 = RES - 0402: Voltage: 50V; Mfg: RS73F1ERTTP5622F; Power: 1/8W; Current: *; CreatedBy: Jonathan Bouchard
R9 = RES - 0402: Mfg Part Number: RMCF0402FT102K; Voltage: 50V; Power: 1/16W; Current: *; CreatedBy: Jonathan Bouchard
R10 R13 = RES - 0402: Mfg Part Number: CR200000F; Voltage: 50V; Power: 1/16W; Current: *; CreatedBy: Jonathan Bouchard
R11 = RES - 0402: as R3 on sheet S7CAS-PLEIADES-CARTE-MERE_P20_Power-Tree-1; Current: *; CreatedBy: Jonathan Bouchard
R12 = RES - 0402: Mfg Part Number: RMCF0402FT64K9; Voltage: 50V; Power: 1/16W; Current: *; CreatedBy: Jonathan Bouchard
U4 = REG_SWR_LMZ34002RKGR: REG - DC DC Converter -3V to -17V 2A - 41-B1QFN; Manufacturer #1: Texas Instruments; Value: -3 ~ -17V; Voltage Rating: 4.5-40V; Power Max: 15W; GRAMS Lib Spec: 2.8c; Magnetic Material: Unknown; Polarized: Yes; Tolerance: *; Current Rating: 2A; HelpURL: http://www.ti.com/lit/ds/symlink/lmz34002.pdf; CreatedBy/Date: P.Marcoux  20-06-2019; VerifiedBy: C.Paulin - 22/01/2020; Temperature: -40°C ~ 85°C; Package: 41-B1QFN; Manufacturer #2: *; Note: *; Assembly Type: SMD; Part Number #2: *; Part Number #1: LMZ34002RKGR; Supplier 1: Digi-Key; Supplier Part Number 1: 296-44356-1-ND; Cryo: UNKNOWN; Mfg Part Number: LMZ34002RKGR
U5 = REG_LDO_TPS7A3301RGWR: REG - LDO Negative Adjustable 1 Output -1.18V-33V 1A -  20-VQFN (5x5); Manufacturer #1: Texas Instruments; Value: -1.18V~-33V; Voltage Rating: -36V; GRAMS Lib Spec: 2.8; Magnetic Material: Unknown; Polarized: Yes; Tolerance: *; Current Rating: 1A; Power Max: *; HelpURL: http://www.ti.com/lit/ds/symlink/tps7a33.pdf; CreatedBy/Date: Keven Deslandes - 2018/10/11; VerifiedBy: Caroline Paulin - 11/12/2018; Temperature: -40°C ~ 125°C; Package: 20-VQFN; Manufacturer #2: *; Assembly Type: SMD; Part Number #2: *; Part Number #1: TPS7A3301RGWR; Supplier 1: Digi-Key; Supplier Part Number 1: 296-39502-1-ND; Cryo: UNKNOWN; Mfg Part Number: TPS7A3301RGWR
U6 = REG_SWR_PTH04T231WAZ: REG - MODULE PIP 6A 2.2V/5.5V - 10SMD; Manufacturer #1: Texas Instruments; Current Rating: 6A (out); Value: 0.69 - 3.6V (Out); Voltage rating: 2.2-5.5V (Input); Polarized: Yes; Magnetic Material: UNKNOWN; Manufacturer #2: *; Note: *; Power Max: *; Part Number #1: PTH04T231WAZ; Part Number #2: *; HelpURL: http://www.ti.com/lit/ds/symlink/pth04t231w.pdf; Supplier 1: Digi-Key; Assembly Type: SMD; Temperature: -40°C ~ 85°C; Supplier Part Number 1: 296-21792-ND; Package: SMD; CreatedBy/Date: Olivier Bernard / 6/5/2018; VerifiedBy: Caroline Paulin / 10 juillet 2018; Cryo: UNKNOWN; Mfg Part Number: PTH04T231WAZ; Parameter 2: *

## Sheet S7CAS-PLEIADES-CARTE-MERE_P20_Power-Tree-3.SchDoc
size Tabloid; SheetNumber: 5; SheetTotal: 20; Sheet_Name: Power Tree 3/3; Size: 11x17
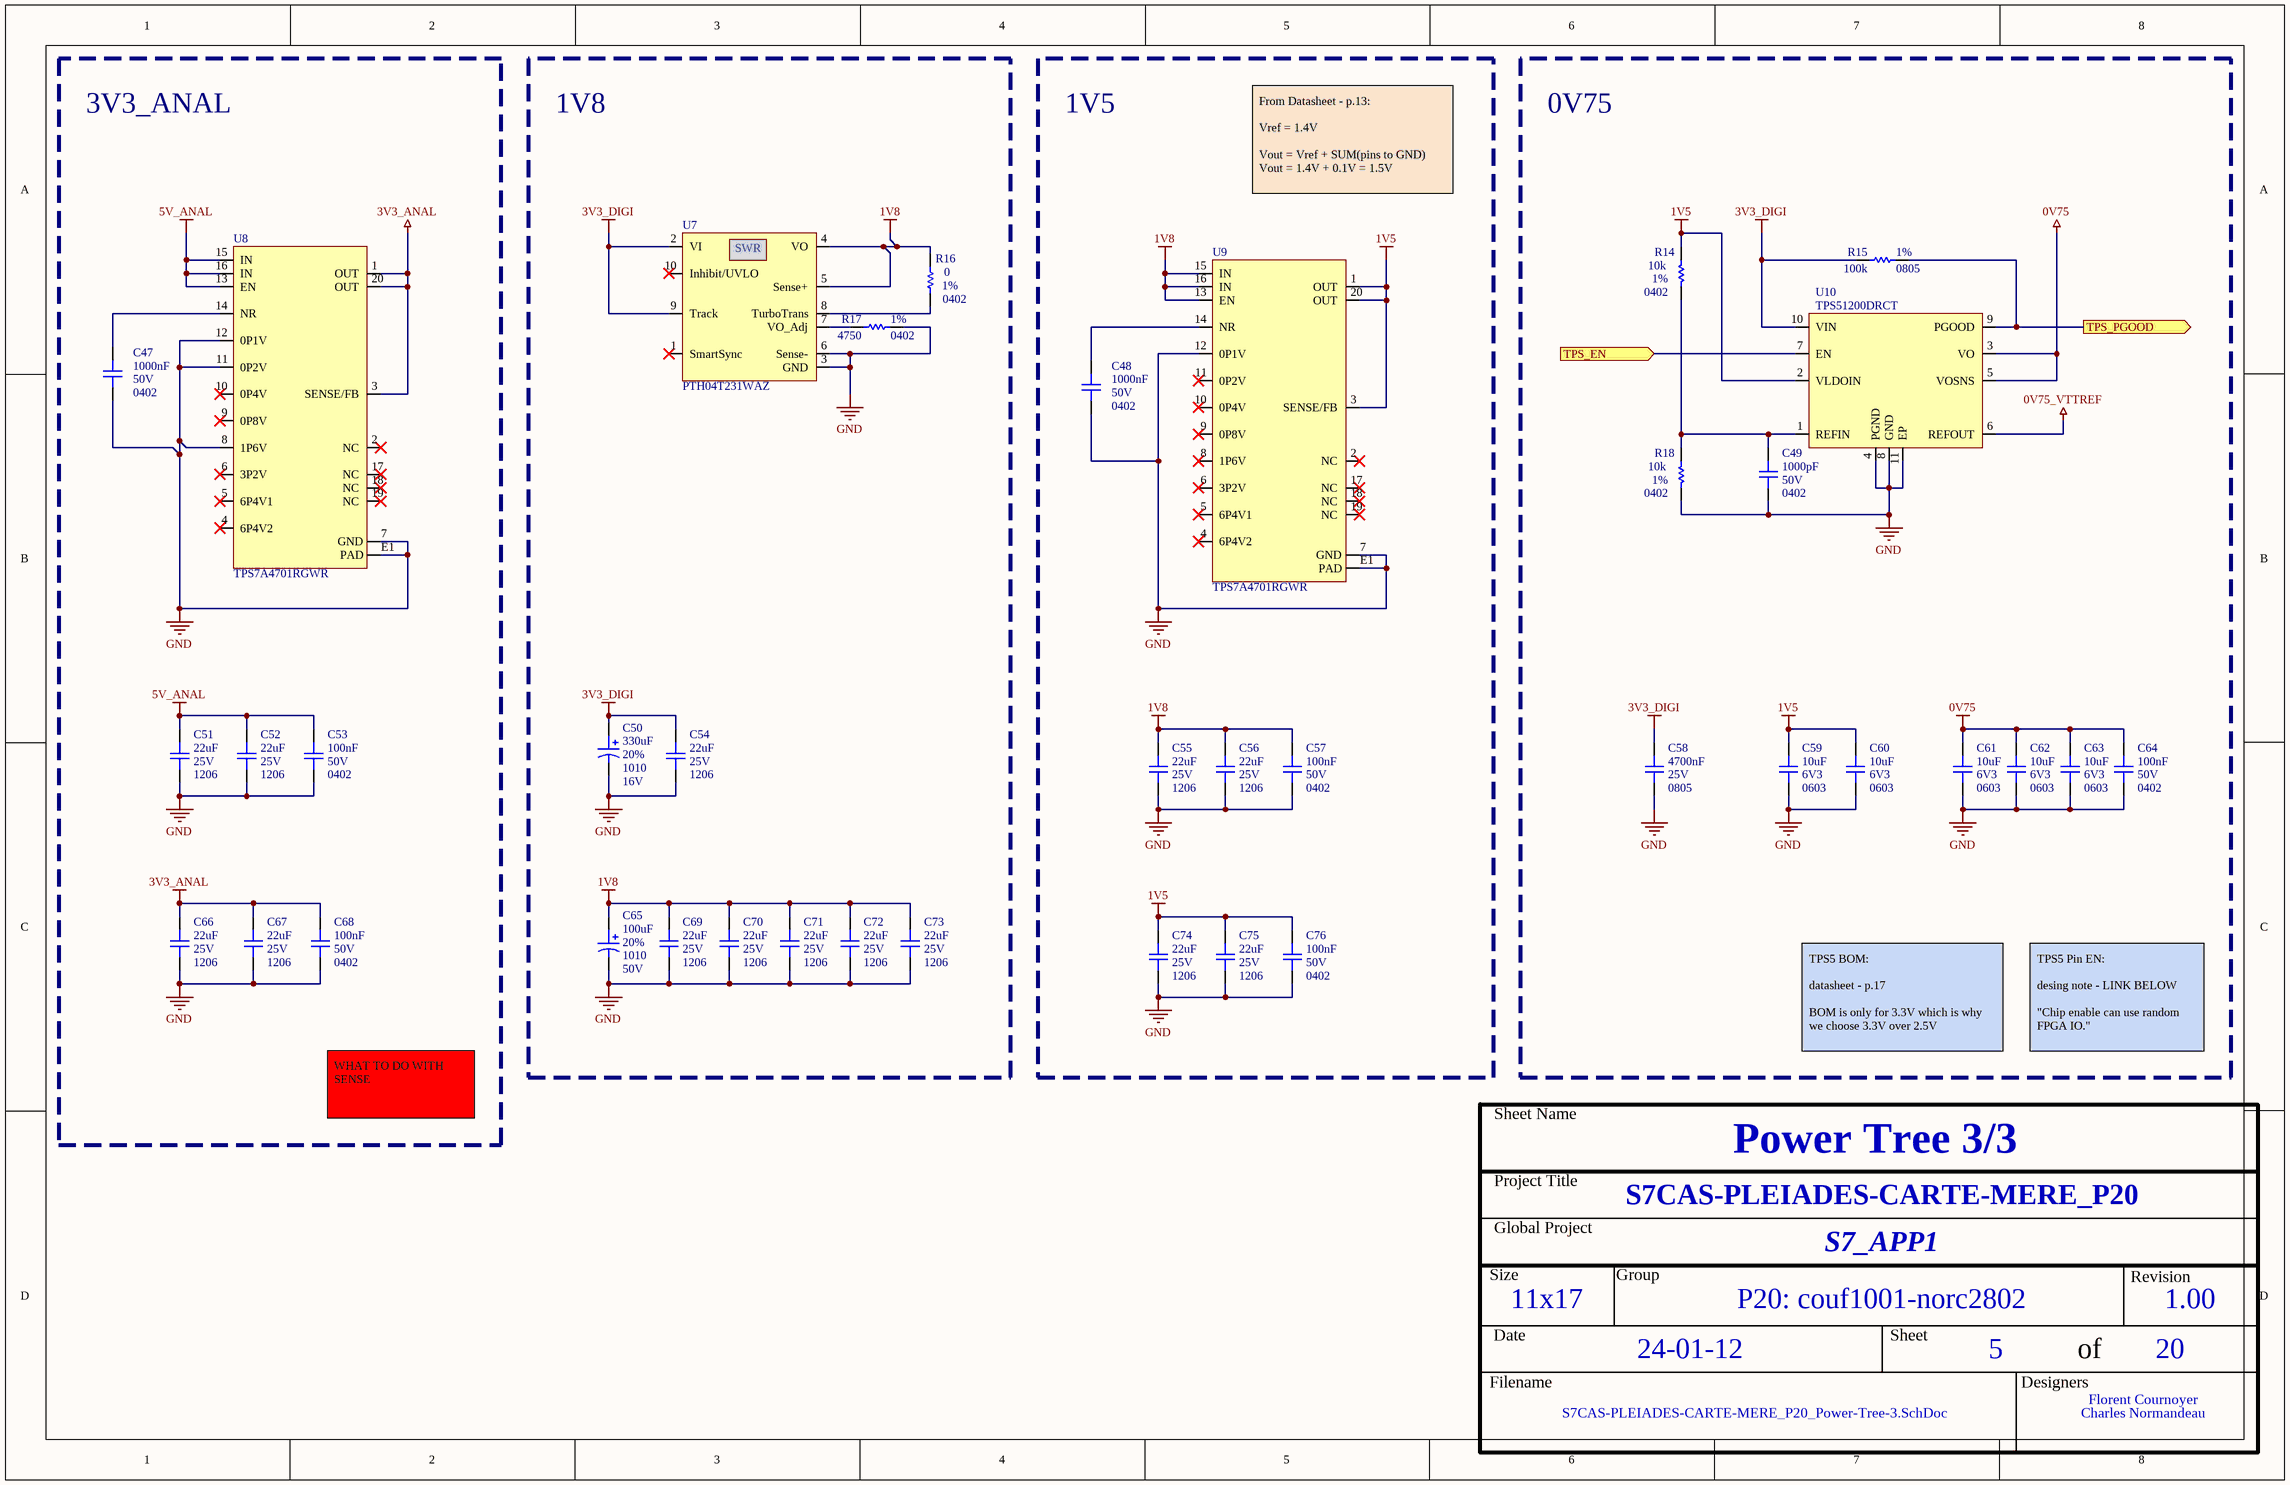
[diagram p4: S7CAS-PLEIADES-CARTE-MERE_P20_Power-Tree-3.SchDoc]

### Parts
(Parts that share a designator on the sheet are numbered #1, #2 ... from top to bottom, then left to right.)
C47  value 1000nF  Voltage: 50V  Package: 0402  [CAP_0402]  (hidden comment: CAP - 0402)
C48  value 1000nF  Voltage: 50V  Package: 0402  [CAP_0402]  (hidden comment: CAP - 0402)
C49  value 1000pF  Voltage: 50V  Package: 0402  [CAP_0201]  (hidden comment: CAP - 0201)
C50  value 330uF  Voltage: 16V  Package: 1010  Precision: 20%  [CAP_ALU_1010_vishay]  (hidden comment: MAL214699501E3)
C51  value 22uF  Voltage: 25V  Package: 1206  [CAP_1206]  (hidden comment: CAP - 1206)
C52  value 22uF  Voltage: 25V  Package: 1206  [CAP_1206]  (hidden comment: CAP - 1206)
C53  value 100nF  Voltage: 50V  Package: 0402  [CAP_0402]  (hidden comment: CAP - 0402)
C54  value 22uF  Voltage: 25V  Package: 1206  [CAP_1206]  (hidden comment: CAP - 1206)
C55  value 22uF  Voltage: 25V  Package: 1206  [CAP_1206]  (hidden comment: CAP - 1206)
C56  value 22uF  Voltage: 25V  Package: 1206  [CAP_1206]  (hidden comment: CAP - 1206)
C57  value 100nF  Voltage: 50V  Package: 0402  [CAP_0402]  (hidden comment: CAP - 0402)
C58  value 4700nF  Voltage: 25V  Package: 0805  [CAP_0805]  (hidden comment: CAP - 0805)
C59  value 10uF  Voltage: 6V3  Package: 0603  [CAP_0603]  (hidden comment: CAP - 0603)
C60  value 10uF  Voltage: 6V3  Package: 0603  [CAP_0603]  (hidden comment: CAP - 0603)
C61  value 10uF  Voltage: 6V3  Package: 0603  [CAP_0603]  (hidden comment: CAP - 0603)
C62  value 10uF  Voltage: 6V3  Package: 0603  [CAP_0603]  (hidden comment: CAP - 0603)
C63  value 10uF  Voltage: 6V3  Package: 0603  [CAP_0603]  (hidden comment: CAP - 0603)
C64  value 100nF  Voltage: 50V  Package: 0402  [CAP_0402]  (hidden comment: CAP - 0402)
C65  value 100uF  Voltage: 50V  Package: 1010  Precision: 20%  [CAP_ALU_1010_vishay]  (hidden comment: MAL215099101E3)
C66  value 22uF  Voltage: 25V  Package: 1206  [CAP_1206]  (hidden comment: CAP - 1206)
C67  value 22uF  Voltage: 25V  Package: 1206  [CAP_1206]  (hidden comment: CAP - 1206)
C68  value 100nF  Voltage: 50V  Package: 0402  [CAP_0402]  (hidden comment: CAP - 0402)
C69  value 22uF  Voltage: 25V  Package: 1206  [CAP_1206]  (hidden comment: CAP - 1206)
C70  value 22uF  Voltage: 25V  Package: 1206  [CAP_1206]  (hidden comment: CAP - 1206)
C71  value 22uF  Voltage: 25V  Package: 1206  [CAP_1206]  (hidden comment: CAP - 1206)
C72  value 22uF  Voltage: 25V  Package: 1206  [CAP_1206]  (hidden comment: CAP - 1206)
C73  value 22uF  Voltage: 25V  Package: 1206  [CAP_1206]  (hidden comment: CAP - 1206)
C74  value 22uF  Voltage: 25V  Package: 1206  [CAP_1206]  (hidden comment: CAP - 1206)
C75  value 22uF  Voltage: 25V  Package: 1206  [CAP_1206]  (hidden comment: CAP - 1206)
C76#1  value 100nF  Voltage: 50V  Package: 0402  [CAP_0402]  (hidden comment: CAP - 0402)
R14  value 10k  Package: 0402  Precision: 1%  [RES_0402]  (hidden comment: RES - 0402)
R15  value 100k  Package: 0805  Precision: 1%  [RES_0805]  (hidden comment: RES - 0805)
R16  value 0  Package: 0402  Precision: 1%  [RES_0402]  (hidden comment: RES - 0402)
R17  value 4750  Package: 0402  Precision: 1%  [RES_0402]  (hidden comment: RES - 0402)
R18  value 10k  Package: 0402  Precision: 1%  [RES_0402]  (hidden comment: RES - 0402)
U7  PTH04T231WAZ  [REG_SWR_PTH04T231WAZ]
U8  TPS7A4701RGWR  [REG_TPS7A4701RGWR]
U9  TPS7A4701RGWR  [REG_TPS7A4701RGWR]
U10  TPS51200DRCT  [REG_PMIC_TPS51200DRCT]

### Blocks framed on the sheet
3V3_ANAL: C47 C51-C53 C66-C68 U8
1V8: C50 C54 C65 C69-C73 R16 R17 U7
1V5: C48 C55-C57 C74 C75 C76#1 U9
0V75: C49 C58-C64 R14 R15 R18 U10

### Ports
TPS_EN (in), TPS_PGOOD (out)

### Nets
0V75: C61.2 C62.2 C63.2 C64.2 U10.3(VO) U10.5(VOSNS)
0V75_VTTREF: U10.6(REFOUT)
1V5: C59.2 C60.2 C74.2 C75.2 C76#1.2 R14.2 U9.1(OUT) U9.3(SENSE/FB) U9.20(OUT) U10.2(VLDOIN)
1V8: C55.2 C56.2 C57.2 C65.1 C69.2 C70.2 C71.2 C72.2 C73.2 R16.2 U7.4(VO) U7.5(Sense+) U9.13(EN) U9.15(IN) U9.16(IN)
3V3_ANAL: C66.2 C67.2 C68.2 U8.1(OUT) U8.3(SENSE/FB) U8.20(OUT)
3V3_DIGI: C50.1 C54.2 C58.2 R15.2 U7.2(VI) U7.9(Track) U10.10(VIN)
5V_ANAL: C51.2 C52.2 C53.2 U8.13(EN) U8.15(IN) U8.16(IN)
GND: C47.2 C48.2 C49.1 C50.2 C51.1 C52.1 C53.1 C54.1 C55.1 C56.1 C57.1 C58.1 C59.1 C60.1 C61.1 C62.1 C63.1 C64.1 C65.2 C66.1 C67.1 C68.1 C69.1 C70.1 C71.1 C72.1 C73.1 C74.1 C75.1 C76#1.1 R17.1 R18.1 U7.3(GND) U7.6(Sense-) U8.7(GND) U8.8(1P6V) U8.11(0P2V) U8.12(0P1V) U8.E1(PAD) U9.7(GND) U9.12(0P1V) U9.E1(PAD) U10.4(PGND) U10.8(GND) U10.11(EP)
TPS_EN: U10.7(EN) ; port TPS_EN
TPS_PGOOD: R15.1 U10.9(PGOOD) ; port TPS_PGOOD
NetC47_1: C47.1 U8.14(NR)
NetC48_1: C48.1 U9.14(NR)
NetC49_2: C49.2 R14.1 R18.2 U10.1(REFIN)
NetR16_1: R16.1 U7.8(TurboTrans)
NetR17_2: R17.2 U7.7(VO_Adj)

Not connected (* = marked no-connect by the designer): U7 1(SmartSync)* 10(Inhibit/UVLO)*; U8 2(NC)* 4(6P4V2)* 5(6P4V1)* 6(3P2V)* 9(0P8V)* 10(0P4V)* 17(NC)* 18(NC)* 19(NC)*; U9 2(NC)* 4(6P4V2)* 5(6P4V1)* 6(3P2V)* 8(1P6V)* 9(0P8V)* 10(0P4V)* 11(0P2V)* 17(NC)* 18(NC)* 19(NC)*

### Notes on the sheet
- From Datasheet - p.13:
  Vref = 1.4V
  Vout = Vref + SUM(pins to GND)
  Vout = 1.4V + 0.1V = 1.5V
- TPS5 BOM:
  datasheet - p.17
  BOM is only for 3.3V which is why we choose 3.3V over 2.5V
- TPS5 Pin EN:
  desing note - LINK BELOW
  "Chip enable can use random FPGA IO."
  https://e2e.ti.com/support/power-management-group/power-management/f/power-management-forum/981448/tps51200-about-slp_s3-in-ddr3-application
- WHAT TO DO WITH SENSE
- Sheet Name
- Project Title
- Global Project
- Size
- Group
- Revision
- Date
- Sheet
- of
- Filename
- Designers
- (in symbol REG_SWR_PTH04T231WAZ) SWR

### Library data of the parts
C47 C48 = CAP - 0402: as C1 on sheet S7CAS-PLEIADES-CARTE-MERE_P20_Power-Tree-1; Current: *; CreatedBy: Jonathan Bouchard; Power: *
C49 = CAP - 0201: Mfg Part Number: GRM0335C1H102JE01; Precision: 10%; Current: *; CreatedBy: Jonathan Bouchard; Power: *
C50 = CAP_ALU_MAL214699501E3: as C3 on sheet S7CAS-PLEIADES-CARTE-MERE_P20_Power-Tree-1; Mfg Part Number: MAL214699501E3; HelpURL: http://www.vishay.com/docs/28403/146cti.pdf; CreatedBy: Jonathan Bouchard; Temperature: -55°C to 125°C; Power: *; Supplier 1: Digikey; Supplier Part Number 1: 4405PHCT-ND
C51 C52 C54-C56 C66 C67 C69-C75 = CAP - 1206: as C4 on sheet S7CAS-PLEIADES-CARTE-MERE_P20_Power-Tree-1; Current: *; HelpURL: https://search.murata.co.jp/Ceramy/image/img/A01X/G101/ENG/GRM31CD71H106KE11-01A.pdf; CreatedBy: Jonathan Bouchard; Power: *
C53 C57 C64 C68 C76#1 = CAP - 0402: as C9 on sheet S7CAS-PLEIADES-CARTE-MERE_P20_Power-Tree-1; Current: *; CreatedBy: Jonathan Bouchard; Power: *
C58 = CAP - 0805: as C29 on sheet S7CAS-PLEIADES-CARTE-MERE_P20_Power-Tree-2; Current: *; CreatedBy: Jonathan Bouchard; Power: *
C59-C63 = CAP - 0603: as C8 on sheet S7CAS-PLEIADES-CARTE-MERE_P20_Power-Tree-1; Current: *; CreatedBy: Jonathan Bouchard; Power: *
C65 = CAP_ALU_MAL215099101E3: as C5 on sheet S7CAS-PLEIADES-CARTE-MERE_P20_Power-Tree-1; Mfg Part Number: MAL215099101E3; HelpURL: http://www.vishay.com/docs/28395/150crz.pdf; CreatedBy: Jonathan Bouchard; Temperature: -55°C to 125°C; Power: *; Supplier 1: Digikey; Supplier Part Number 1: 4399PHDKR-ND
R14 R18 = RES - 0402: Mfg Part Number: MCS04020C1002FE000; Voltage: 50V; Power: 1/16W; Current: *; CreatedBy: Jonathan Bouchard
R15 = RES - 0805: Mfg Part Number: CRM0805-FX-1003ELF; Current: *; CreatedBy: Jonathan Bouchard
R16 = RES - 0402: as R10 on sheet S7CAS-PLEIADES-CARTE-MERE_P20_Power-Tree-2; Current: *; CreatedBy: Jonathan Bouchard
R17 = RES - 0402: Mfg Part Number: CR0402-FX-4751GLF; Voltage: 50V; Power: 1/16W; Current: *; CreatedBy: Jonathan Bouchard
U7 = REG_SWR_PTH04T231WAZ: as U6 on sheet S7CAS-PLEIADES-CARTE-MERE_P20_Power-Tree-2; Manufacturer #2: *; Note: *; Power Max: *; Part Number #1: PTH04T231WAZ; Part Number #2: *; HelpURL: http://www.ti.com/lit/ds/symlink/pth04t231w.pdf; Supplier 1: Digi-Key; Assembly Type: SMD; Temperature: -40°C ~ 85°C; Supplier Part Number 1: 296-21792-ND; Package: SMD; CreatedBy/Date: Olivier Bernard / 6/5/2018; VerifiedBy: Caroline Paulin / 10 juillet 2018; Cryo: UNKNOWN; Mfg Part Number: PTH04T231WAZ
U8 U9 = REG_LDO_TPS7A4701RGWR: as U1 on sheet S7CAS-PLEIADES-CARTE-MERE_P20_Power-Tree-1; Assembly Type: SMD; CreatedBy/Date: L-P Gauthier / 2018-05-29; Current Rating: 1A; Manufacturer #2: TBD; Part Number #1: TPS7A4701RGWR; Part Number #2: TBD; Package: 20-VQFN Exposed Pad; Power Max: *; Tolerance: -; Supplier 1: Digi-Key; Supplier Part Number 1: 296-37224-1-ND; VerifiedBy: Caroline Paulin - 28 sept 2018; Temperature: -40°C ~ 125°C; HelpURL: http://www.ti.com/lit/ds/symlink/tps7a47.pdf; Cryo: UNKNOWN; Mfg Part Number: TPS7A4701RGWR
U10 = REG_PMIC_TPS51200DRCT: REG - DDR TERMINATION/REF REG - 10-VFDFN; Manufacturer #1: Texas Instruments; Value: DDR, DDR2, DDR3(L), DDR4; Voltage Rating: 2.375V ~ 3.5V; Current Rating: Source: 3A~4.5A, Sink: 3.5A~5.5A; GRAMS Lib Spec: 2.8; Magnetic Material: Unknown; Polarized: Yes; Tolerance: *; Power Max: *; HelpURL: http://www.ti.com/lit/ds/symlink/tps51200.pdf; CreatedBy/Date: Joel Lemay 2019-03-19; VerifiedBy: Nicolas V. (2019-05-31); Temperature: -40°C ~ 85°C; Package: 10-VFDFN; Manufacturer #2: *; Note: *; Assembly Type: SMD; Part Number #2: *; Part Number #1: TPS51200DRCT; Supplier 1: Digi-Key; Supplier Part Number 1: 296-23830-1-ND; Cryo: UNKNOWN; Mfg Part Number: TPS51200DRCT

## Sheet S7CAS-PLEIADES-CARTE-MERE_P20_DDR3-FPGA-Bank-3.SchDoc
size Tabloid; SheetNumber: 6; SheetTotal: 20; Sheet_Name: DDR3; Size: 11x17
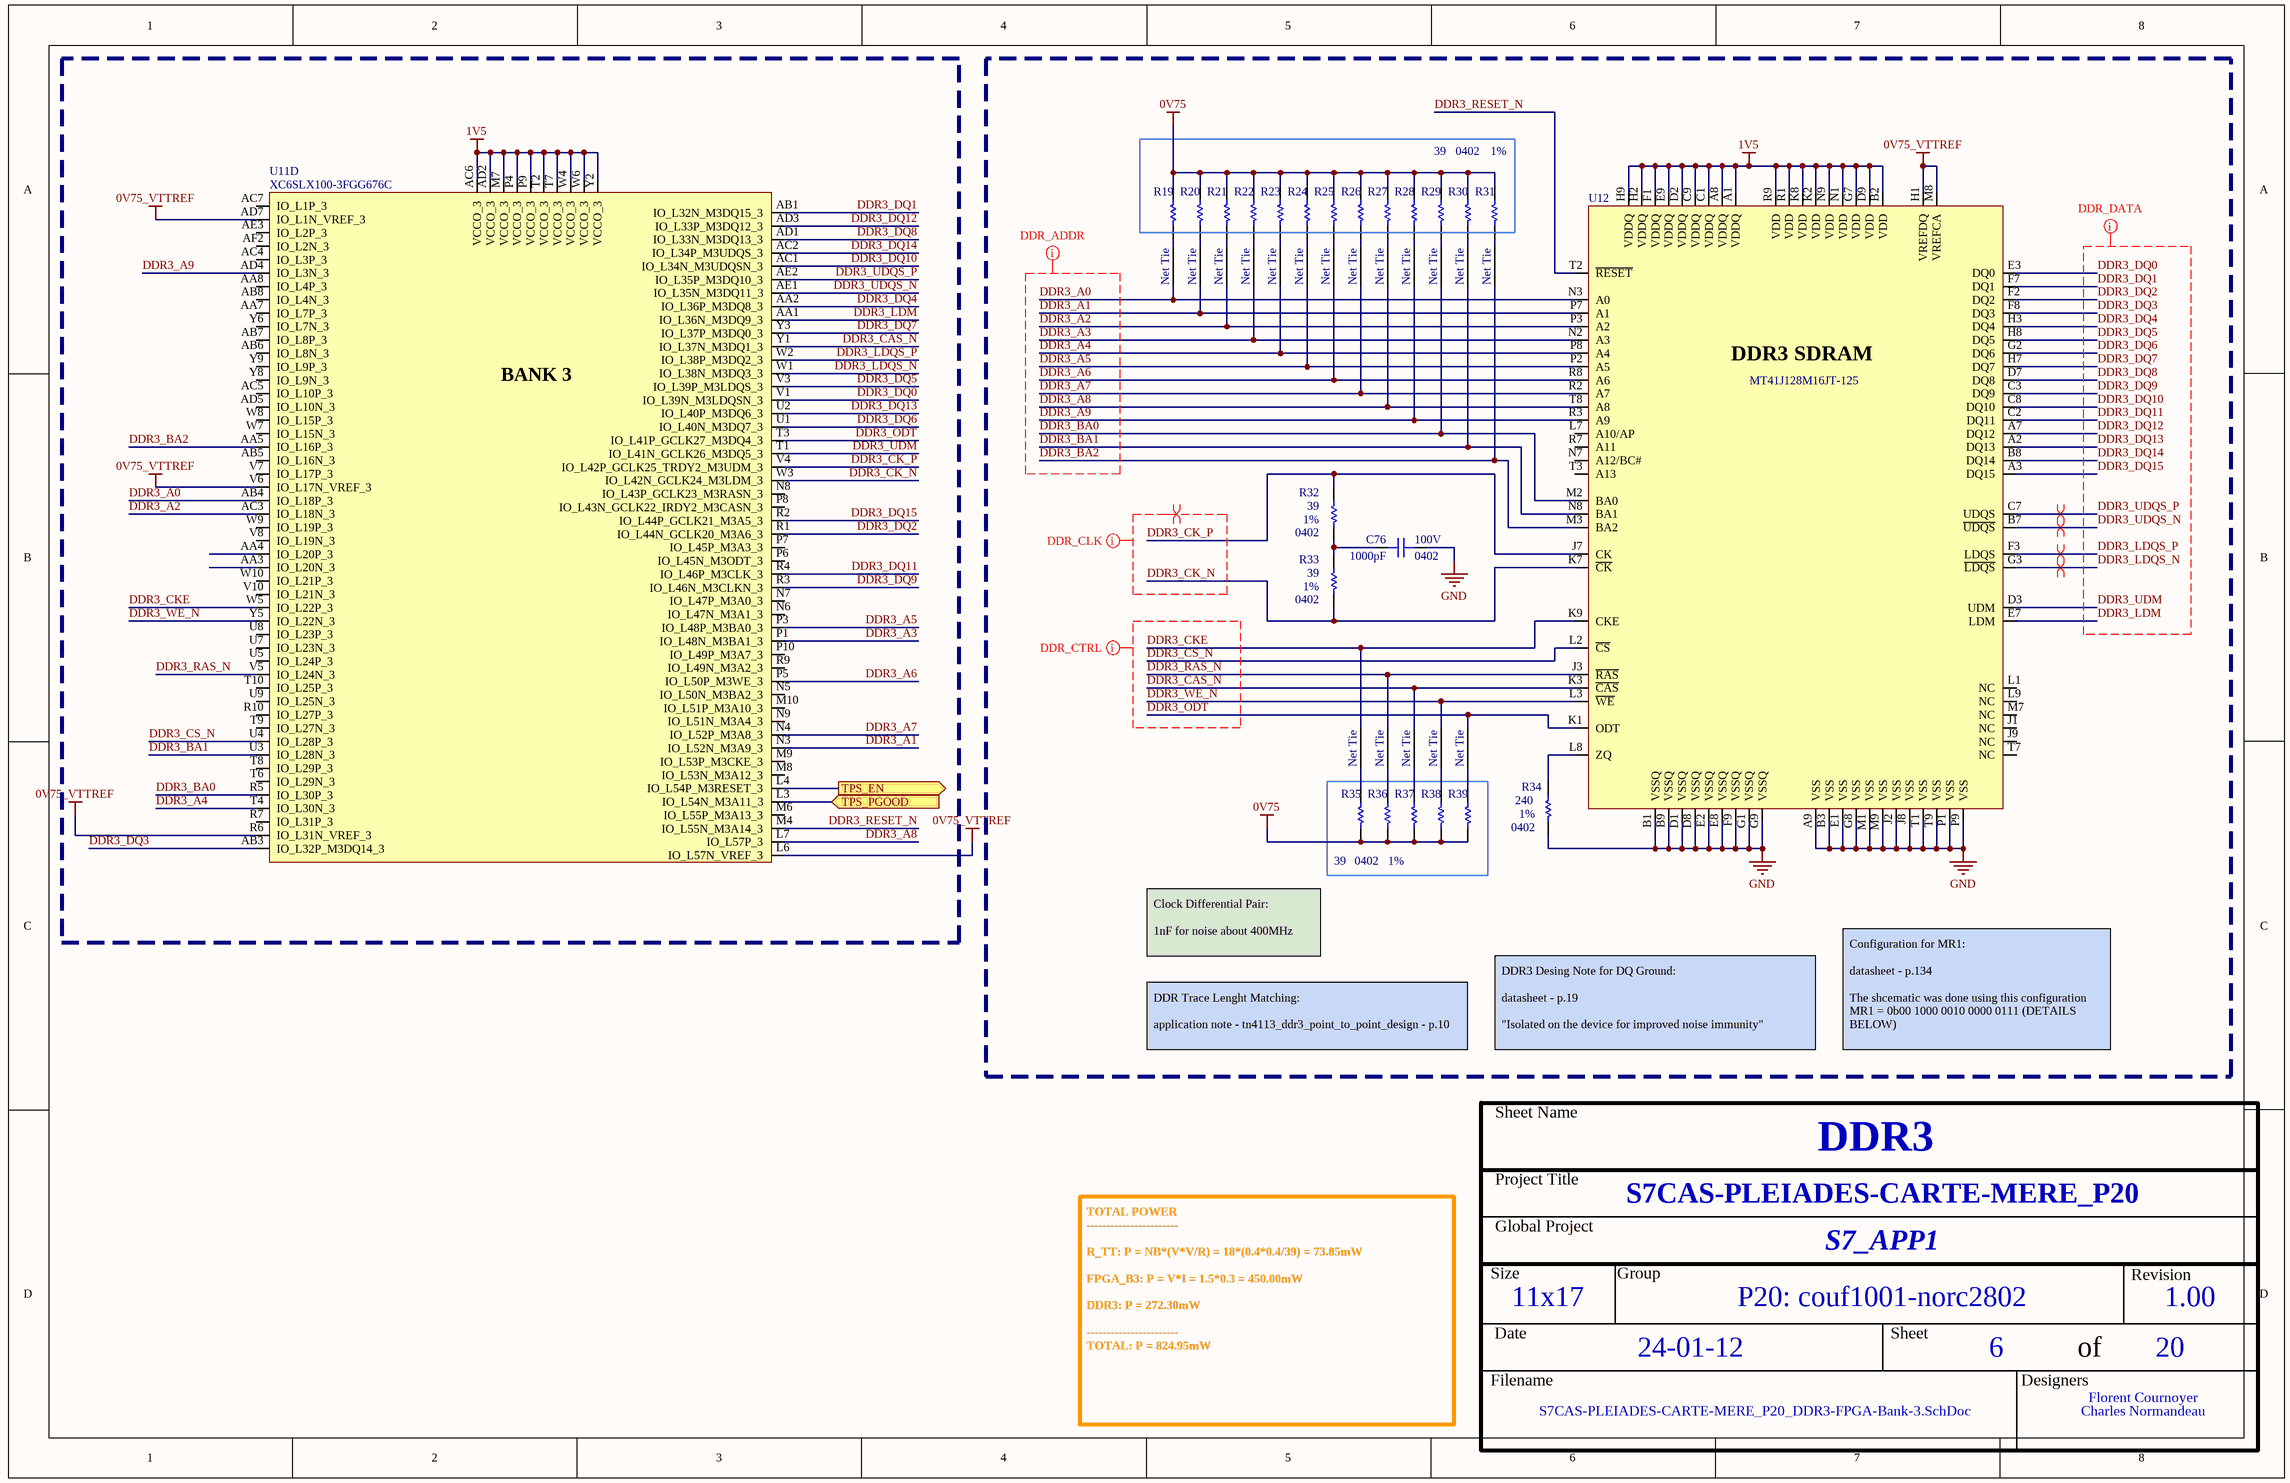
[diagram p5: S7CAS-PLEIADES-CARTE-MERE_P20_DDR3-FPGA-Bank-3.SchDoc]

### Parts
(Parts that share a designator on the sheet are numbered #1, #2 ... from top to bottom, then left to right.)
C76#2  value 1000pF  Voltage: 100V  Package: 0402  [CAP_0402]  (hidden comment: CAP - 0402)
NT1  Net Tie  [Net Tie]  (net tie, no BOM)
NT2  Net Tie  [Net Tie]  (net tie, no BOM)
NT3  Net Tie  [Net Tie]  (net tie, no BOM)
NT4  Net Tie  [Net Tie]  (net tie, no BOM)
NT5  Net Tie  [Net Tie]  (net tie, no BOM)
NT6  Net Tie  [Net Tie]  (net tie, no BOM)
NT7  Net Tie  [Net Tie]  (net tie, no BOM)
NT8  Net Tie  [Net Tie]  (net tie, no BOM)
NT9  Net Tie  [Net Tie]  (net tie, no BOM)
NT10  Net Tie  [Net Tie]  (net tie, no BOM)
NT11  Net Tie  [Net Tie]  (net tie, no BOM)
NT12  Net Tie  [Net Tie]  (net tie, no BOM)
NT13  Net Tie  [Net Tie]  (net tie, no BOM)
NT14  Net Tie  [Net Tie]  (net tie, no BOM)
NT15  Net Tie  [Net Tie]  (net tie, no BOM)
NT16  Net Tie  [Net Tie]  (net tie, no BOM)
NT17  Net Tie  [Net Tie]  (net tie, no BOM)
NT18  Net Tie  [Net Tie]  (net tie, no BOM)
R19  value 39  Package: 0402  Precision: 1%  [RES_0402]  (hidden comment: RES - 0402)
R20  RES - 0402  [RES_0402]  (value not drawn)
R21  RES - 0402  [RES_0402]  (value not drawn)
R22  RES - 0402  [RES_0402]  (value not drawn)
R23  RES - 0402  [RES_0402]  (value not drawn)
R24  RES - 0402  [RES_0402]  (value not drawn)
R25  RES - 0402  [RES_0402]  (value not drawn)
R26  RES - 0402  [RES_0402]  (value not drawn)
R27  RES - 0402  [RES_0402]  (value not drawn)
R28  RES - 0402  [RES_0402]  (value not drawn)
R29  RES - 0402  [RES_0402]  (value not drawn)
R30  RES - 0402  [RES_0402]  (value not drawn)
R31  RES - 0402  [RES_0402]  (value not drawn)
R32  value 39  Package: 0402  Precision: 1%  [RES_0402]  (hidden comment: RES - 0402)
R33  value 39  Package: 0402  Precision: 1%  [RES_0402]  (hidden comment: RES - 0402)
R34  value 240  Package: 0402  Precision: 1%  [RES_0402]  (hidden comment: RES - 0402)
R35  value 39  Package: 0402  Precision: 1%  [RES_0402]  (hidden comment: RES - 0402)
R36  RES - 0402  [RES_0402]  (value not drawn)
R37  RES - 0402  [RES_0402]  (value not drawn)
R38  RES - 0402  [RES_0402]  (value not drawn)
R39  RES - 0402  [RES_0402]  (value not drawn)
U11  XC6SLX100-3FGG676C  [FPGA_XILINX_FGG676]  (part D of 10)
U12  MT41J128M16JT-125  [MEM_DDR3_MT41J128M16JT-125]

### Ports
TPS_EN (out), TPS_PGOOD (in)

### Nets
0V75: R19.2 R20.2 R21.2 R22.2 R23.2 R24.2 R25.2 R26.2 R27.2 R28.2 R29.2 R30.2 R31.2 R35.1 R36.1 R37.1 R38.1 R39.1
0V75_VTTREF: U11.AD7(IO_L1N_VREF_3) U11.L6(IO_L57N_VREF_3) U11.R6(IO_L31N_VREF_3) U11.V6(IO_L17N_VREF_3) U12.H1(VREFDQ) U12.M8(VREFCA)
1V5: U11.AC6(VCCO_3) U11.AD2(VCCO_3) U11.M7(VCCO_3) U11.P4(VCCO_3) U11.P9(VCCO_3) U11.T2(VCCO_3) U11.T7(VCCO_3) U11.W4(VCCO_3) U11.W6(VCCO_3) U11.Y2(VCCO_3) U12.A1(VDDQ) U12.A8(VDDQ) U12.B2(VDD) U12.C1(VDDQ) U12.C9(VDDQ) U12.D2(VDDQ) U12.D9(VDD) U12.E9(VDDQ) U12.F1(VDDQ) U12.G7(VDD) U12.H2(VDDQ) U12.H9(VDDQ) U12.K2(VDD) U12.K8(VDD) U12.N1(VDD) U12.N9(VDD) U12.R1(VDD) U12.R9(VDD)
GND: C76#2.1 R34.1 U12.A9(VSS) U12.B1(VSSQ) U12.B3(VSS) U12.B9(VSSQ) U12.D1(VSSQ) U12.D8(VSSQ) U12.E1(VSS) U12.E2(VSSQ) U12.E8(VSSQ) U12.F9(VSSQ) U12.G1(VSSQ) U12.G8(VSS) U12.G9(VSSQ) U12.J2(VSS) U12.J8(VSS) U12.M1(VSS) U12.M9(VSS) U12.P1(VSS) U12.P9(VSS) U12.T1(VSS) U12.T9(VSS)
DDR3_A0: NT1.1 U11.AB4(IO_L18P_3) U12.N3(A0)
DDR3_A1: NT2.1 U11.N3(IO_L52N_M3A9_3) U12.P7(A1)
DDR3_A2: NT3.1 U11.AC3(IO_L18N_3) U12.P3(A2)
DDR3_A3: NT4.1 U11.P1(IO_L48N_M3BA1_3) U12.N2(A3)
DDR3_A4: NT5.1 U11.T4(IO_L30N_3) U12.P8(A4)
DDR3_A5: NT6.1 U11.P3(IO_L48P_M3BA0_3) U12.P2(A5)
DDR3_A6: NT7.1 U11.P5(IO_L50P_M3WE_3) U12.R8(A6)
DDR3_A7: NT8.1 U11.N4(IO_L52P_M3A8_3) U12.R2(A7)
DDR3_A8: NT9.1 U11.L7(IO_L57P_3) U12.T8(A8)
DDR3_A9: NT10.1 U11.AD4(IO_L3N_3) U12.R3(A9)
DDR3_BA0: NT11.1 U11.R5(IO_L30P_3) U12.M2(BA0)
DDR3_BA1: NT12.1 U11.U3(IO_L28N_3) U12.N8(BA1)
DDR3_BA2: NT13.1 U11.AA5(IO_L16P_3) U12.M3(BA2)
DDR3_CAS_N: NT16.2 U11.Y1(IO_L37N_M3DQ1_3) U12.K3(~{CAS})
DDR3_CK_N: R33.1 U11.W3(IO_L42N_GCLK24_M3LDM_3) U12.K7(~{CK})
DDR3_CK_P: R32.2 U11.V4(IO_L42P_GCLK25_TRDY2_M3UDM_3) U12.J7(CK)
DDR3_CKE: NT14.2 U11.W5(IO_L22P_3) U12.K9(CKE)
DDR3_CS_N: U11.U4(IO_L28P_3) U12.L2(~{CS})
DDR3_DQ0: U11.V1(IO_L39N_M3LDQSN_3) U12.E3(DQ0)
DDR3_DQ1: U11.AB1(IO_L32N_M3DQ15_3) U12.F7(DQ1)
DDR3_DQ2: U11.R1(IO_L44N_GCLK20_M3A6_3) U12.F2(DQ2)
DDR3_DQ3: U11.AB3(IO_L32P_M3DQ14_3) U12.F8(DQ3)
DDR3_DQ4: U11.AA2(IO_L36P_M3DQ8_3) U12.H3(DQ4)
DDR3_DQ5: U11.V3(IO_L39P_M3LDQS_3) U12.H8(DQ5)
DDR3_DQ6: U11.U1(IO_L40N_M3DQ7_3) U12.G2(DQ6)
DDR3_DQ7: U11.Y3(IO_L37P_M3DQ0_3) U12.H7(DQ7)
DDR3_DQ8: U11.AD1(IO_L33N_M3DQ13_3) U12.D7(DQ8)
DDR3_DQ9: U11.R3(IO_L46N_M3CLKN_3) U12.C3(DQ9)
DDR3_DQ10: U11.AC1(IO_L34N_M3UDQSN_3) U12.C8(DQ10)
DDR3_DQ11: U11.R4(IO_L46P_M3CLK_3) U12.C2(DQ11)
DDR3_DQ12: U11.AD3(IO_L33P_M3DQ12_3) U12.A7(DQ12)
DDR3_DQ13: U11.U2(IO_L40P_M3DQ6_3) U12.A2(DQ13)
DDR3_DQ14: U11.AC2(IO_L34P_M3UDQS_3) U12.B8(DQ14)
DDR3_DQ15: U11.R2(IO_L44P_GCLK21_M3A5_3) U12.A3(DQ15)
DDR3_LDM: U11.AA1(IO_L36N_M3DQ9_3) U12.E7(LDM)
DDR3_LDQS_N: U11.W1(IO_L38N_M3DQ3_3) U12.G3(~{LDQS})
DDR3_LDQS_P: U11.W2(IO_L38P_M3DQ2_3) U12.F3(LDQS)
DDR3_ODT: NT18.2 U11.T3(IO_L41P_GCLK27_M3DQ4_3) U12.K1(ODT)
DDR3_RAS_N: NT15.2 U11.V5(IO_L24N_3) U12.J3(~{RAS})
DDR3_RESET_N: U11.M4(IO_L55N_M3A14_3) U12.T2(~{RESET})
DDR3_UDM: U11.T1(IO_L41N_GCLK26_M3DQ5_3) U12.D3(UDM)
DDR3_UDQS_N: U11.AE1(IO_L35N_M3DQ11_3) U12.B7(~{UDQS})
DDR3_UDQS_P: U11.AE2(IO_L35P_M3DQ10_3) U12.C7(UDQS)
DDR3_WE_N: NT17.2 U11.Y5(IO_L22N_3) U12.L3(~{WE})
TPS_EN: U11.L4(IO_L54P_M3RESET_3) ; port TPS_EN
TPS_PGOOD: U11.L3(IO_L54N_M3A11_3) ; port TPS_PGOOD
NetC76#2_2: C76#2.2 R32.1 R33.2
NetNT1_2: NT1.2 R19.1
NetNT2_2: NT2.2 R20.1
NetNT3_2: NT3.2 R21.1
NetNT4_2: NT4.2 R22.1
NetNT5_2: NT5.2 R23.1
NetNT6_2: NT6.2 R24.1
NetNT7_2: NT7.2 R25.1
NetNT8_2: NT8.2 R26.1
NetNT9_2: NT9.2 R27.1
NetNT10_2: NT10.2 R28.1
NetNT11_2: NT11.2 R29.1
NetNT12_2: NT12.2 R30.1
NetNT13_2: NT13.2 R31.1
NetNT14_1: NT14.1 R35.2
NetNT15_1: NT15.1 R36.2
NetNT16_1: NT16.1 R37.2
NetNT17_1: NT17.1 R38.2
NetNT18_1: NT18.1 R39.2
NetR34_2: R34.2 U12.L8(ZQ)

Not connected (* = marked no-connect by the designer): U11 AA3(IO_L20N_3) AA4(IO_L20P_3) AA7(IO_L7P_3) AA8(IO_L4P_3) AB5(IO_L16N_3) AB6(IO_L8N_3) AB7(IO_L8P_3) AB8(IO_L4N_3) AC4(IO_L3P_3) AC5(IO_L10P_3) AC7(IO_L1P_3) AD5(IO_L10N_3) AE3(IO_L2P_3) AF2(IO_L2N_3) M6(IO_L55P_M3A13_3) M8(IO_L53N_M3A12_3) M9(IO_L53P_M3CKE_3) M10(IO_L51P_M3A10_3) N5(IO_L50N_M3BA2_3) N6(IO_L47N_M3A1_3) N7(IO_L47P_M3A0_3) N8(IO_L43P_GCLK23_M3RASN_3) N9(IO_L51N_M3A4_3) P6(IO_L45N_M3ODT_3) P7(IO_L45P_M3A3_3) P8(IO_L43N_GCLK22_IRDY2_M3CASN_3) P10(IO_L49P_M3A7_3) R7(IO_L31P_3) R9(IO_L49N_M3A2_3) R10(IO_L27P_3) T6(IO_L29N_3) T8(IO_L29P_3) T9(IO_L27N_3) T10(IO_L25P_3) U5(IO_L24P_3) U7(IO_L23N_3) U8(IO_L23P_3) U9(IO_L25N_3) V7(IO_L17P_3) V8(IO_L19N_3) V10(IO_L21N_3) W7(IO_L15N_3) W8(IO_L15P_3) W9(IO_L19P_3) W10(IO_L21P_3) Y6(IO_L7N_3) Y8(IO_L9N_3) Y9(IO_L9P_3); U12 J1(NC) J9(NC) L1(NC) L7(A10/AP) L9(NC) M7(NC) N7(A12/BC#) R7(A11) T3(A13) T7(NC)

### Layout directives
net class TRACKS_40; net class DDR_ADDR: DDR3_A0, DDR3_A1, DDR3_A2, DDR3_A3, DDR3_A4, DDR3_A5, DDR3_A6, DDR3_A7, DDR3_A8, DDR3_A9, DDR3_BA0, DDR3_BA1, DDR3_BA2
net class TRACKS_40; net class DDR_DATA: DDR3_DQ0, DDR3_DQ1, DDR3_DQ2, DDR3_DQ3, DDR3_DQ4, DDR3_DQ5, DDR3_DQ6, DDR3_DQ7, DDR3_DQ8, DDR3_DQ9, DDR3_DQ10, DDR3_DQ11, DDR3_DQ12, DDR3_DQ13, DDR3_DQ14, DDR3_DQ15, DDR3_LDM, DDR3_LDQS_N, DDR3_LDQS_P, DDR3_UDM, DDR3_UDQS_N, DDR3_UDQS_P
differential pair: DDR3_CK_N, DDR3_CK_P, DDR3_LDQS_N, DDR3_LDQS_P, DDR3_UDQS_N, DDR3_UDQS_P
net class TRACKS_40; net class DDR_CTRL: DDR3_CAS_N, DDR3_CKE, DDR3_CS_N, DDR3_ODT, DDR3_RAS_N, DDR3_WE_N
net class TRACKS_40; net class DDR_CLK: DDR3_CK_N, DDR3_CK_P

### Notes on the sheet
- Clock Differential Pair:
  1nF for noise about 400MHz
- DDR Trace Lenght Matching:
  application note - tn4113_ddr3_point_to_point_design - p.10
- DDR3 Desing Note for DQ Ground:
  datasheet - p.19
  "Isolated on the device for improved noise immunity"
- Configuration for MR1:
  datasheet - p.134
  The shcematic was done using this configuration MR1 = 0b00 1000 0010 0000 0111 (DETAILS BELOW)
  17 = 0
  16 = 0
  15 = 1
  14 = 0
  13 = 0
  12 = 0
  11 = 0
  10 = 0
  9 = 1
  8 = 0
  7 = 0
  6 = 0
  5 = 0
  4 = 0
  3 = 0
  2 = 1
  1 = 1
  0 = 1
- TOTAL POWER
  -----------------------
  R_TT: P = NB*(V*V/R) = 18*(0.4*0.4/39) = 73.85mW
  FPGA_B3: P = V*I = 1.5*0.3 = 450.00mW
  DDR3: P = 272.30mW
  -----------------------
  TOTAL: P = 824.95mW
- Sheet Name
- Project Title
- Global Project
- Size
- Group
- Revision
- Date
- Sheet
- of
- Filename
- Designers
- (in symbol FPGA_XC6SLX100-3FGG676C, part D) BANK 3
- (in symbol MEM_DDR3_MT41J128M16JT-125:K TR) DDR3 SDRAM

### Library data of the parts
C76#2 = CAP - 0402: Mfg Part Number: GRM155R72A102KA01; Precision: 10%; Current: *; CreatedBy: Jonathan Bouchard; Power: *
NT1-NT18 = NET_TIE: Net Tie for DDR3 lenght matching; GRAMS Lib Spec: 2.7
R19 = RES - 0402: Mfg Part Number: RL0510S-390-F; Voltage: 50V; Power: 1/16W; Current: *; CreatedBy: Jonathan Bouchard
R20-R31 = RES - 0402: Mfg Part Number: RL0510S-390-F; Voltage: 50V; Power: 1/16W; Precision: 1%; Value: 39; Current: *; CreatedBy: Jonathan Bouchard; Package: 0402
R32 R33 R35 = RES - 0402: Mfg Part Number: RL0510S-390-F; Voltage: 50; Power: 1/16W; Current: *; CreatedBy: Jonathan Bouchard
R34 = RES - 0402: Mfg Part Number: ERA-2AEB241X; Voltage: 50V; Power: 1/2W; Current: *; CreatedBy: Jonathan Bouchard
R36-R39 = RES - 0402: Mfg Part Number: RL0510S-390-F; Voltage: 50; Power: 1/16W; Precision: 1%; Value: 39; Current: *; CreatedBy: Jonathan Bouchard; Package: 0402
U11 = FPGA_XC6SLX100-3FGG676C: FPGA - XILINX SPARTAN 6 480 I/O - BGA-676; Voltage: 1.14 V ~ 1.26 V; Current: *; Power: *; Mfg: Xilinx; Mfg Part Number: XC6SLX100-3FGG676C; HelpURL: https://www.xilinx.com/support/documentation/data_sheets/ds162.pdf; CreatedBy: Jonathan Bouchard; Temperature: 0°C ~ 85°C (TJ); Value: *; Precision: *; Package: BGA-676; Supplier 1: Digikey; Supplier Part Number 1: 122-1760-ND
U12 = MEM_DDR3_MT41J128M16JT-125:K TR: MEM - DDR3 SDRAM 2GBIT 800MHZ - TFBGA-96; Voltage: 1.425 V ~ 1.575 V; Mfg: Micrel; Current: *; Power: *; Mfg Part Number: MT41J128M16JT-125; HelpURL: http://www.micron.com/~/media/Documents/Products/Data%20Sheet/DRAM/DDR3/2Gb_DDR3_SDRAM.pdf; CreatedBy: Jonathan Bouchard; Temperature: 0°C ~ 95°C (TC); Value: *; Precision: *; Package: TFBGA-96; Supplier 1: Digikey; Supplier Part Number 1: 557-1611-1-ND